# EAGLE schematic CounterModule (EAGLE 7.7.0)

## Sheet 1 of 6: Entrypoint All functionality is connected to the ARM/ZYNC processor by using the I2C-bus. A I2C bus multiplexer (U1) adresses the individual function blocks.
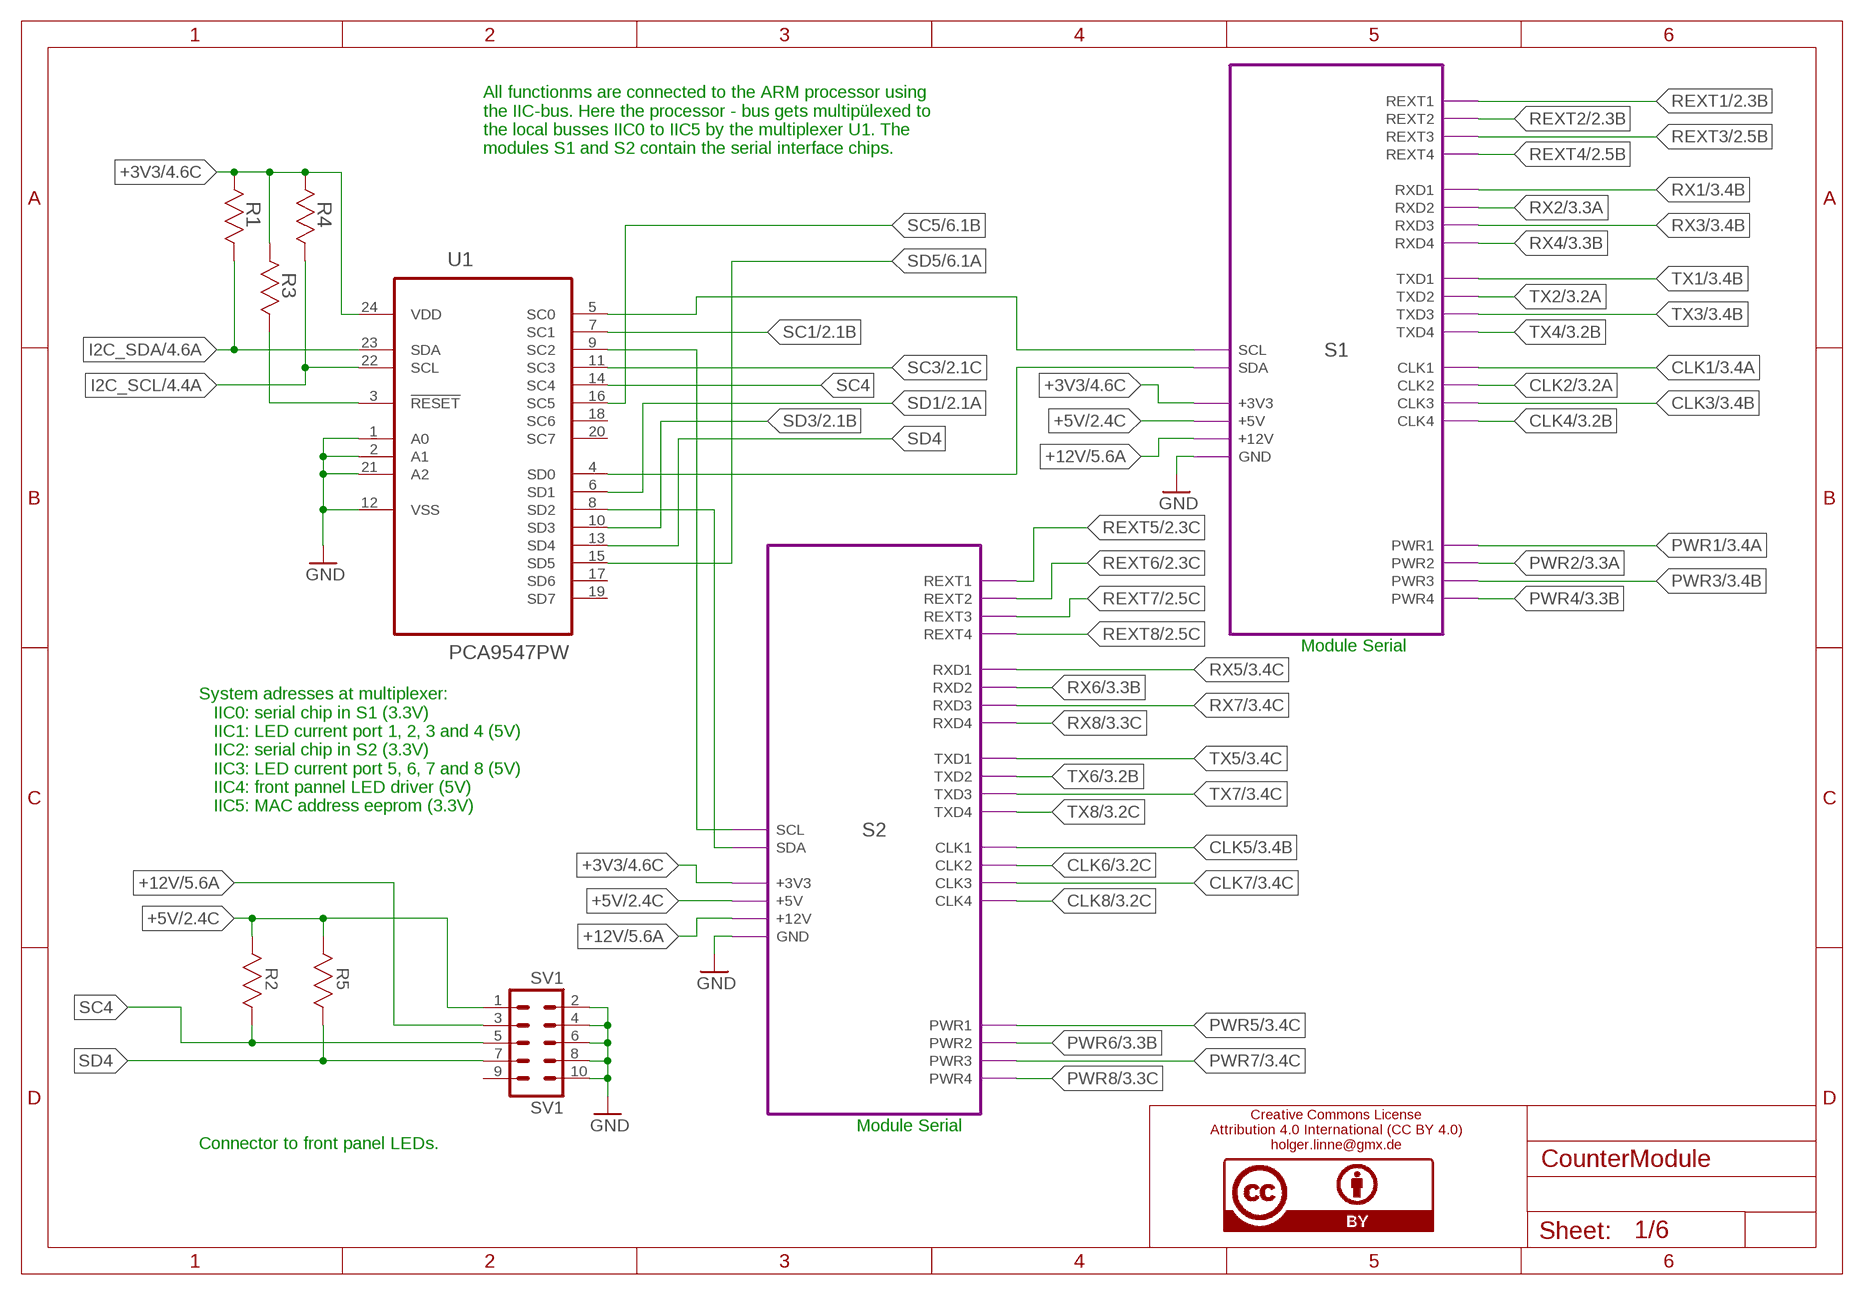
[diagram p0: schematic, sheet 1]

### Parts
R1  4.7 kOhm  ERJ-2RKF4701X  [RESC1005X40N]
R2  4.7 kOhm  ERJ-2RKF4701X  [RESC1005X40N]
R3  4.7 kOhm  ERJ-2RKF4701X  [RESC1005X40N]
R4  4.7 kOhm  ERJ-2RKF4701X  [RESC1005X40N]
R5  4.7 kOhm  ERJ-2RKF4701X  [RESC1005X40N]
SV1  SV1  ML10  [ML10]
U1  PCA9547PW  [SOP65P640X110-24N]

### Module instances
S1 = SERIAL (part numbers offset by 1700)
S2 = SERIAL (part numbers offset by 2700)

### Nets
+3V3 [power]: R1.2(R2) R3.2(R2) R4.2(R2) U1.24(VDD) ; port S1.+3V3 S2.+3V3 ; also sheet 4,5,6
+5V [power]: R2.2(R2) R5.2(R2) SV1.1 ; port S1.+5V S2.+5V ; also sheet 2,4,5,6
+12V [xpower]: SV1.3 ; port S1.+12V S2.+12V ; also sheet 5
CLK1: port S1.CLK1 ; also sheet 3
CLK2: port S1.CLK2 ; also sheet 3
CLK3: port S1.CLK3 ; also sheet 3
CLK4: port S1.CLK4 ; also sheet 3
CLK5: port S2.CLK1 ; also sheet 3
CLK6: port S2.CLK2 ; also sheet 3
CLK7: port S2.CLK3 ; also sheet 3
CLK8: port S2.CLK4 ; also sheet 3
GND [power]: SV1.2 SV1.4 SV1.6 SV1.8 SV1.10 U1.1(A0) U1.2(A1) U1.12(VSS) U1.21(A2) ; port S1.GND S2.GND ; also sheet 2,3,4,5,6
I2C_SCL: R4.1(R1) U1.22(SCL) ; also sheet 4
I2C_SDA: R1.1(R1) U1.23(SDA) ; also sheet 4
N$1: U1.8(SD2) ; port S2.SDA
N$2: U1.9(SC2) ; port S2.SCL
N$3: R3.1(R1) U1.3(!RESET)
PWR1 [xpower]: port S1.PWR1 ; also sheet 3
PWR2 [xpower]: port S1.PWR2 ; also sheet 3
PWR3 [xpower]: port S1.PWR3 ; also sheet 3
PWR4 [xpower]: port S1.PWR4 ; also sheet 3
PWR5 [xpower]: port S2.PWR1 ; also sheet 3
PWR6 [xpower]: port S2.PWR2 ; also sheet 3
PWR7 [xpower]: port S2.PWR3 ; also sheet 3
PWR8 [xpower]: port S2.PWR4 ; also sheet 3
REXT1: port S1.REXT1 ; also sheet 2
REXT2: port S1.REXT2 ; also sheet 2
REXT3: port S1.REXT3 ; also sheet 2
REXT4: port S1.REXT4 ; also sheet 2
REXT5: port S2.REXT1 ; also sheet 2
REXT6: port S2.REXT2 ; also sheet 2
REXT7: port S2.REXT3 ; also sheet 2
REXT8: port S2.REXT4 ; also sheet 2
RX1: port S1.RXD1 ; also sheet 3
RX2: port S1.RXD2 ; also sheet 3
RX3: port S1.RXD3 ; also sheet 3
RX4: port S1.RXD4 ; also sheet 3
RX5: port S2.RXD1 ; also sheet 3
RX6: port S2.RXD2 ; also sheet 3
RX7: port S2.RXD3 ; also sheet 3
RX8: port S2.RXD4 ; also sheet 3
SC0: U1.5(SC0) ; port S1.SCL
SC1: U1.7(SC1) ; also sheet 2
SC3: U1.11(SC3) ; also sheet 2
SC4: R2.1(R1) SV1.5 U1.14(SC4)
SC5: U1.16(SC5) ; also sheet 6
SD0: U1.4(SD0) ; port S1.SDA
SD1: U1.6(SD1) ; also sheet 2
SD3: U1.10(SD3) ; also sheet 2
SD4: R5.1(R1) SV1.7 U1.13(SD4)
SD5: U1.15(SD5) ; also sheet 6
TX1: port S1.TXD1 ; also sheet 3
TX2: port S1.TXD2 ; also sheet 3
TX3: port S1.TXD3 ; also sheet 3
TX4: port S1.TXD4 ; also sheet 3
TX5: port S2.TXD1 ; also sheet 3
TX6: port S2.TXD2 ; also sheet 3
TX7: port S2.TXD3 ; also sheet 3
TX8: port S2.TXD4 ; also sheet 3
Unconnected: SV1.9 U1.17(SD6) U1.18(SC6) U1.19(SD7) U1.20(SC7)

### Notes on the sheet
- All functionms are connected to the ARM processor using
  the IIC-bus. Here the processor - bus gets multipülexed to
  the local busses IIC0 to IIC5 by the multiplexer U1. The
  modules S1 and S2 contain the serial interface chips.
- Module Serial
- System adresses at multiplexer:
     IIC0: serial chip in S1 (3.3V)
     IIC1: LED current port 1, 2, 3 and 4 (5V)
     IIC2: serial chip in S2 (3.3V)
     IIC3: LED current port 5, 6, 7 and 8 (5V)
     IIC4: front pannel LED driver (5V)
     IIC5: MAC address eeprom (3.3V)
- Module Serial
- Connector to front panel LEDs.
- Creative Commons License
  Attribution 4.0 International (CC BY 4.0)
  holger.linne@gmx.de
- /Users/hll/bypig.bmp

## Sheet 2 of 6: LED current controlling variable resistors
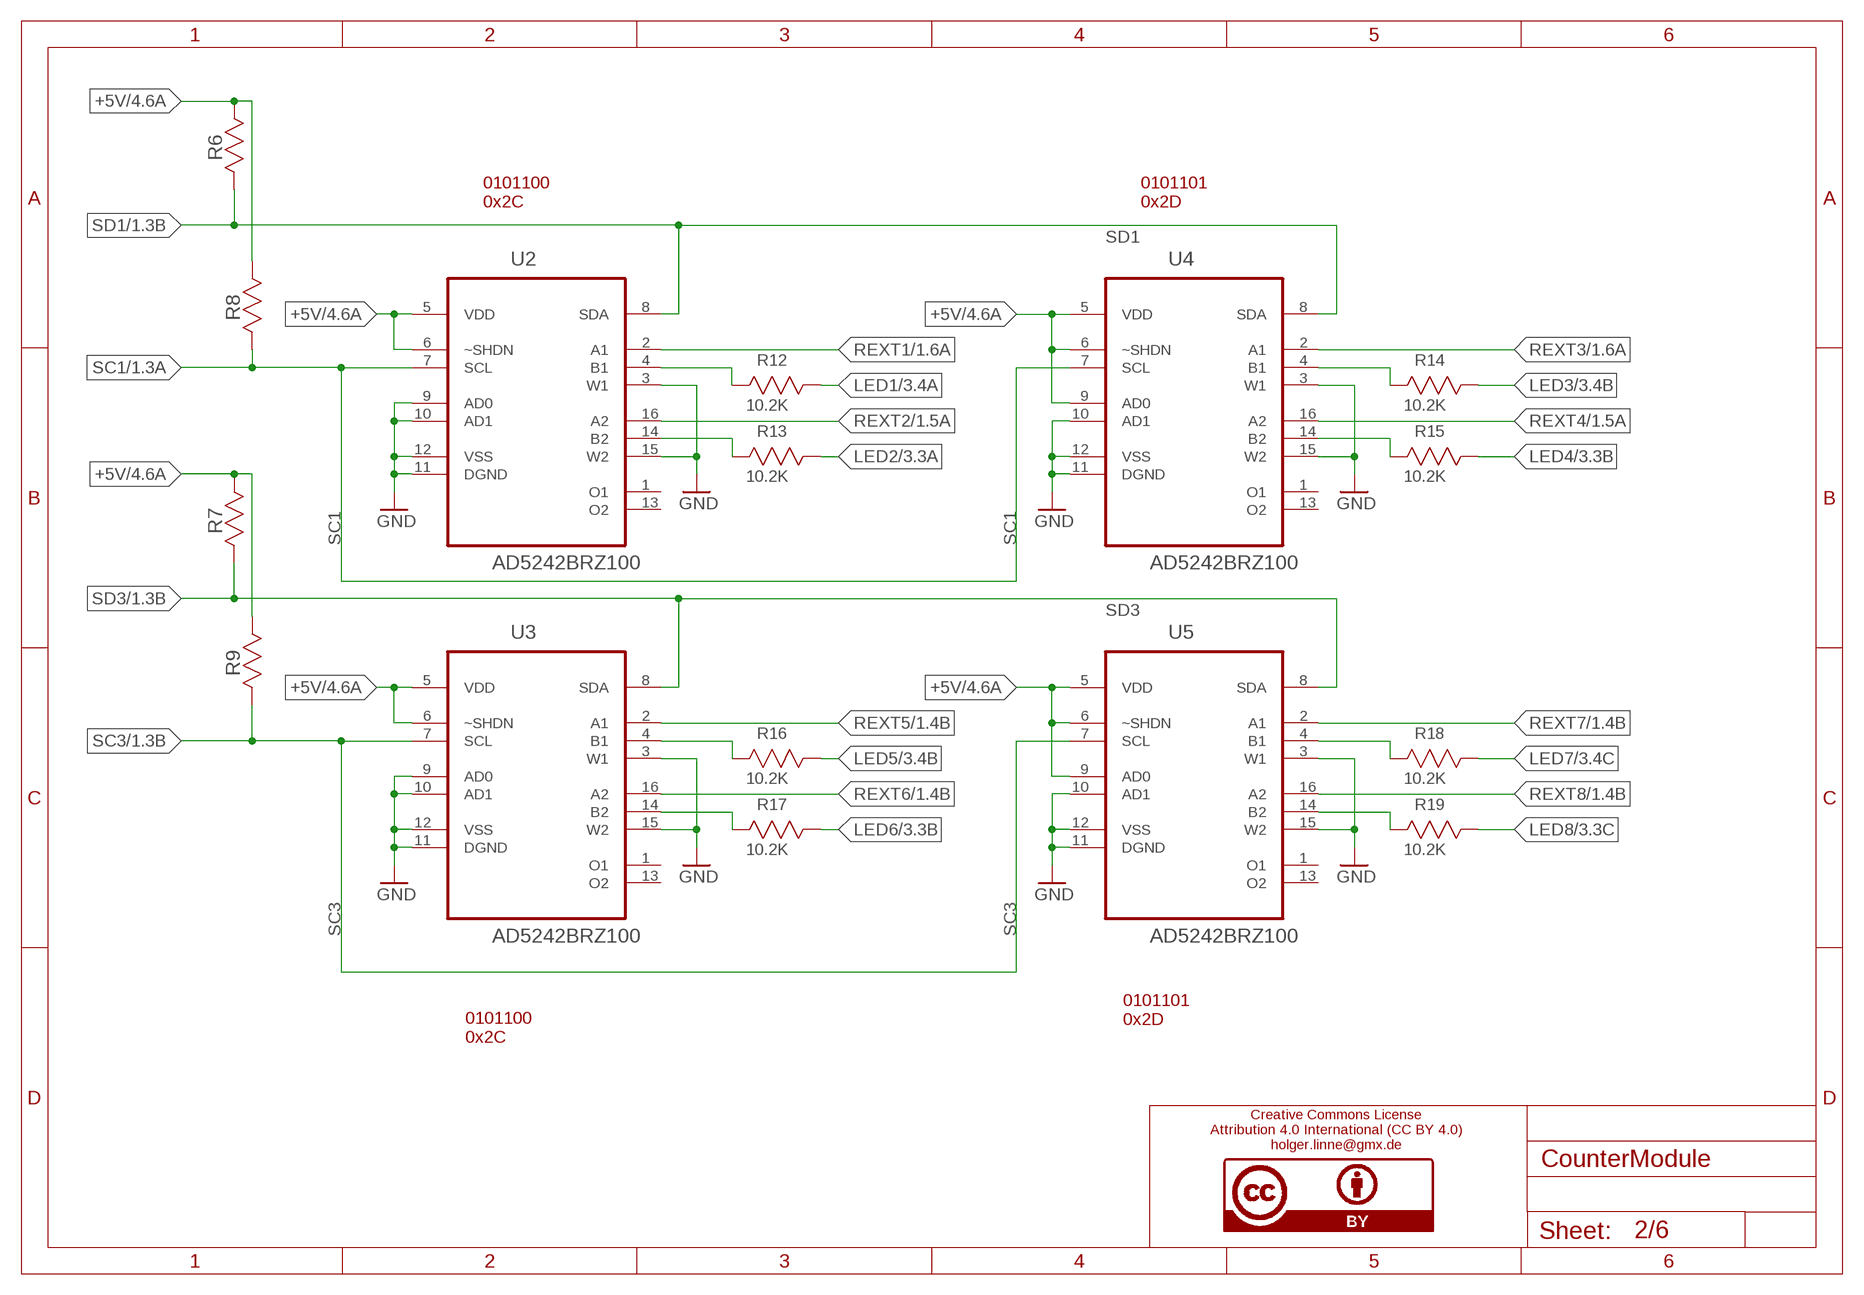
[diagram p1: schematic, sheet 2]

### Parts
R6  4.7 kOhm  ERJ-2RKF4701X  [RESC1005X40N]
R7  4.7 kOhm  ERJ-2RKF4701X  [RESC1005X40N]
R8  4.7 kOhm  ERJ-2RKF4701X  [RESC1005X40N]
R9  4.7 kOhm  ERJ-2RKF4701X  [RESC1005X40N]
R12  10.2K  ERJ-2RKF1022X  [RESC1005X40N]
R13  10.2K  ERJ-2RKF1022X  [RESC1005X40N]
R14  10.2K  ERJ-2RKF1022X  [RESC1005X40N]
R15  10.2K  ERJ-2RKF1022X  [RESC1005X40N]
R16  10.2K  ERJ-2RKF1022X  [RESC1005X40N]
R17  10.2K  ERJ-2RKF1022X  [RESC1005X40N]
R18  10.2K  ERJ-2RKF1022X  [RESC1005X40N]
R19  10.2K  ERJ-2RKF1022X  [RESC1005X40N]
U2  AD5242BRZ100  [SOIC127P600X175-16N]
U3  AD5242BRZ100  [SOIC127P600X175-16N]
U4  AD5242BRZ100  [SOIC127P600X175-16N]
U5  AD5242BRZ100  [SOIC127P600X175-16N]

### Nets
+5V [power]: R6.1(R1) R7.1(R1) R8.1(R1) R9.1(R1) U2.5(VDD) U2.6(~SHDN) U3.5(VDD) U3.6(~SHDN) U4.5(VDD) U4.6(~SHDN) U4.9(AD0) U5.5(VDD) U5.6(~SHDN) U5.9(AD0) ; also sheet 1,4,5,6
GND [power]: U2.3(W1) U2.9(AD0) U2.10(AD1) U2.11(DGND) U2.12(VSS) U2.15(W2) U3.3(W1) U3.9(AD0) U3.10(AD1) U3.11(DGND) U3.12(VSS) U3.15(W2) U4.3(W1) U4.10(AD1) U4.11(DGND) U4.12(VSS) U4.15(W2) U5.3(W1) U5.10(AD1) U5.11(DGND) U5.12(VSS) U5.15(W2) ; also sheet 1,3,4,5,6
LED1: R12.1(R1) ; also sheet 3
LED2: R13.1(R1) ; also sheet 3
LED3: R14.1(R1) ; also sheet 3
LED4: R15.1(R1) ; also sheet 3
LED5: R16.1(R1) ; also sheet 3
LED6: R17.1(R1) ; also sheet 3
LED7: R18.1(R1) ; also sheet 3
LED8: R19.1(R1) ; also sheet 3
N$4: R16.2(R2) U3.4(B1)
N$8: R17.2(R2) U3.14(B2)
N$9: R19.2(R2) U5.14(B2)
N$10: R18.2(R2) U5.4(B1)
N$11: R12.2(R2) U2.4(B1)
N$12: R13.2(R2) U2.14(B2)
N$13: R15.2(R2) U4.14(B2)
N$14: R14.2(R2) U4.4(B1)
REXT1: U2.2(A1) ; also sheet 1
REXT2: U2.16(A2) ; also sheet 1
REXT3: U4.2(A1) ; also sheet 1
REXT4: U4.16(A2) ; also sheet 1
REXT5: U3.2(A1) ; also sheet 1
REXT6: U3.16(A2) ; also sheet 1
REXT7: U5.2(A1) ; also sheet 1
REXT8: U5.16(A2) ; also sheet 1
SC1: R8.2(R2) U2.7(SCL) U4.7(SCL) ; also sheet 1
SC3: R9.2(R2) U3.7(SCL) U5.7(SCL) ; also sheet 1
SD1: R6.2(R2) U2.8(SDA) U4.8(SDA) ; also sheet 1
SD3: R7.2(R2) U3.8(SDA) U5.8(SDA) ; also sheet 1
Unconnected: U2.1(O1) U2.13(O2) U3.1(O1) U3.13(O2) U4.1(O1) U4.13(O2) U5.1(O1) U5.13(O2)

### Notes on the sheet
- 0101100
  0x2C
- 0101101
  0x2D
- 0101101
  0x2D
- 0101100
  0x2C
- Creative Commons License
  Attribution 4.0 International (CC BY 4.0)
  holger.linne@gmx.de
- /Users/hll/bypig.bmp

## Sheet 3 of 6: RJ45 PMT head connector
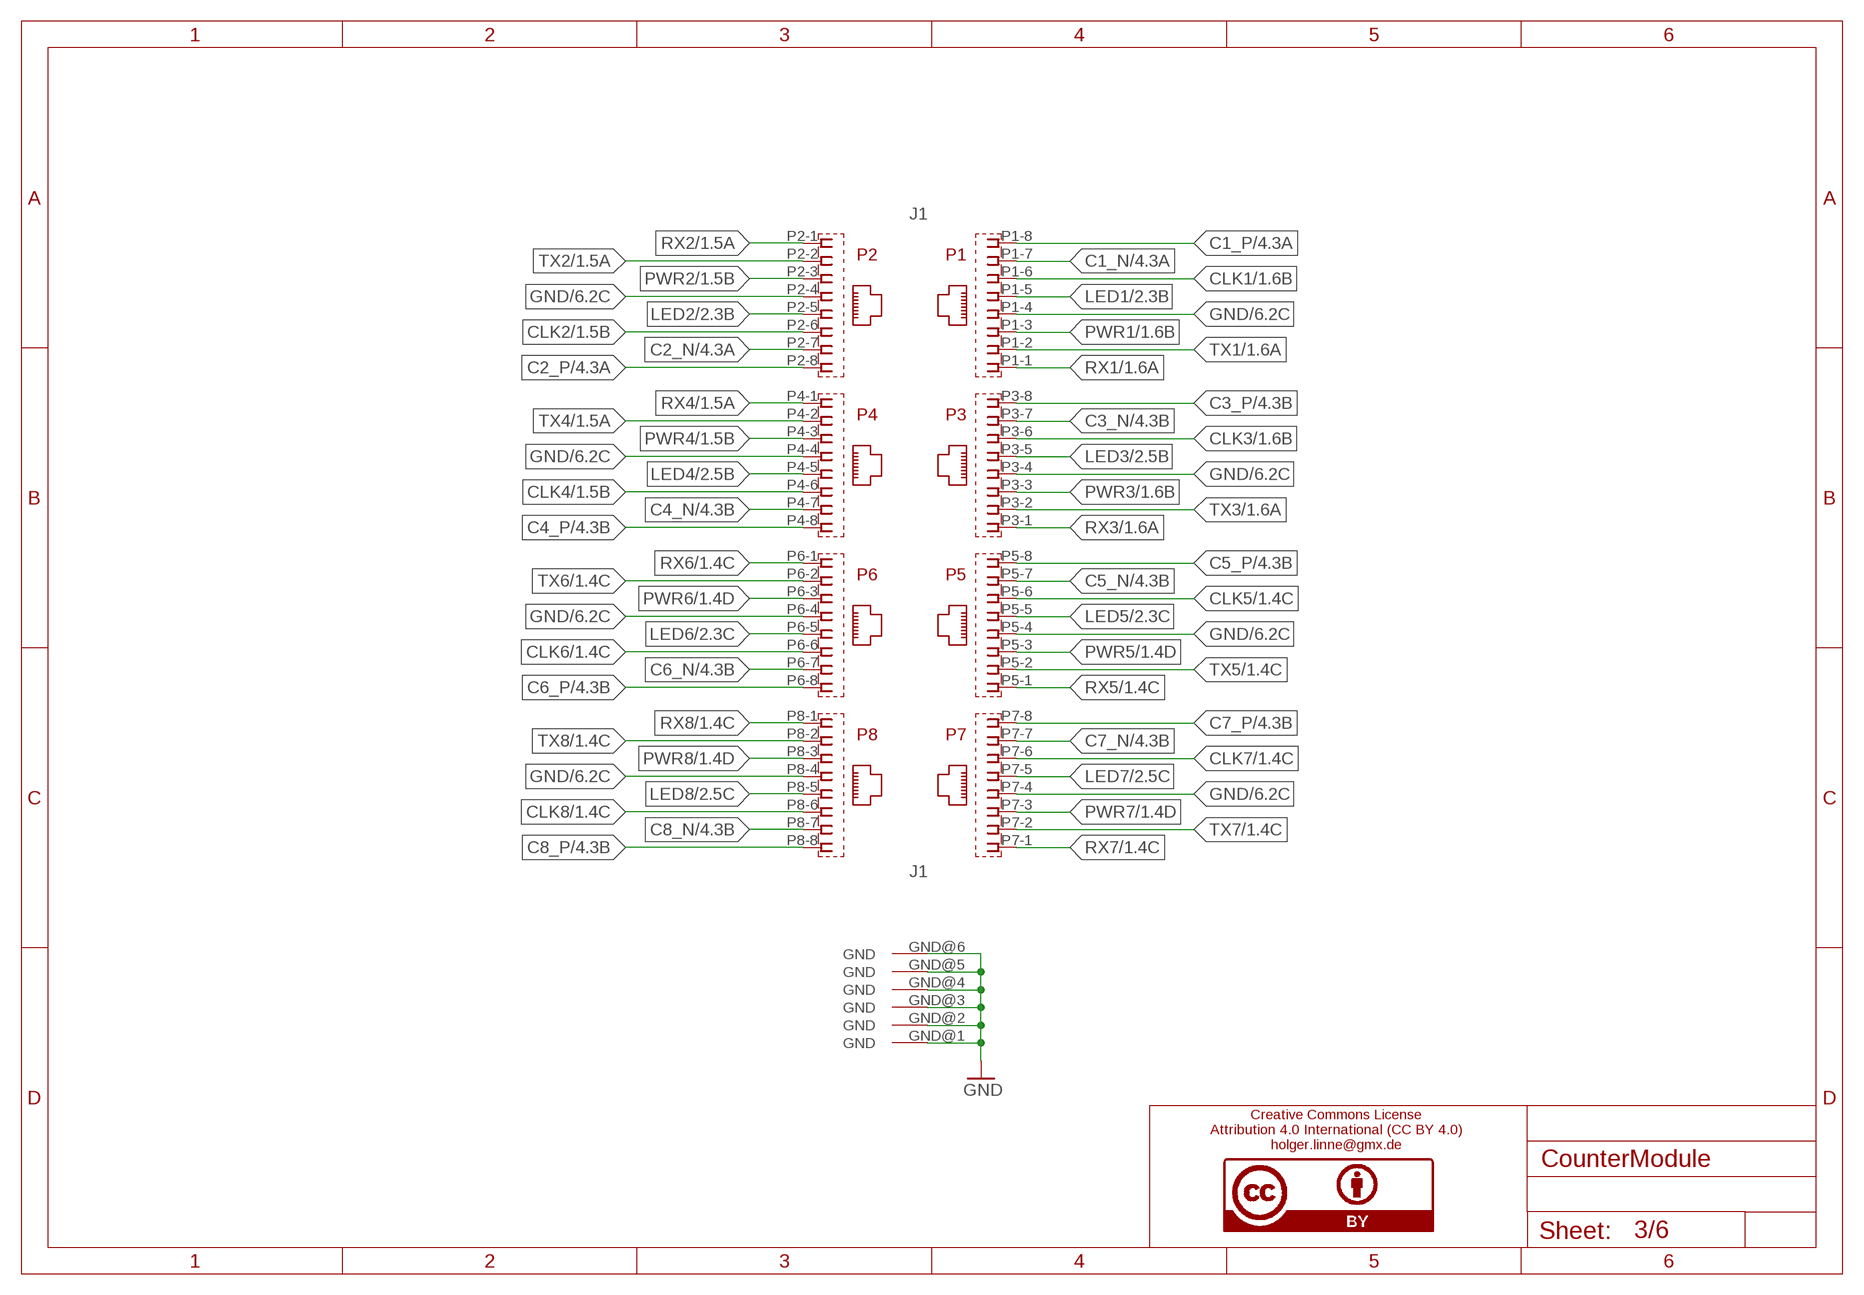
[diagram p2: schematic, sheet 3]

### Parts
J1  J1  AMP2X4  [AMP2X4]

### Nets
C1_N: J1.P1-7 ; also sheet 4
C1_P: J1.P1-8 ; also sheet 4
C2_N: J1.P2-7 ; also sheet 4
C2_P: J1.P2-8 ; also sheet 4
C3_N: J1.P3-7 ; also sheet 4
C3_P: J1.P3-8 ; also sheet 4
C4_N: J1.P4-7 ; also sheet 4
C4_P: J1.P4-8 ; also sheet 4
C5_N: J1.P5-7 ; also sheet 4
C5_P: J1.P5-8 ; also sheet 4
C6_N: J1.P6-7 ; also sheet 4
C6_P: J1.P6-8 ; also sheet 4
C7_N: J1.P7-7 ; also sheet 4
C7_P: J1.P7-8 ; also sheet 4
C8_N: J1.P8-7 ; also sheet 4
C8_P: J1.P8-8 ; also sheet 4
CLK1: J1.P1-6 ; also sheet 1
CLK2: J1.P2-6 ; also sheet 1
CLK3: J1.P3-6 ; also sheet 1
CLK4: J1.P4-6 ; also sheet 1
CLK5: J1.P5-6 ; also sheet 1
CLK6: J1.P6-6 ; also sheet 1
CLK7: J1.P7-6 ; also sheet 1
CLK8: J1.P8-6 ; also sheet 1
GND [power]: J1.GND@1(GND) J1.GND@2(GND) J1.GND@3(GND) J1.GND@4(GND) J1.GND@5(GND) J1.GND@6(GND) J1.P1-4 J1.P2-4 J1.P3-4 J1.P4-4 J1.P5-4 J1.P6-4 J1.P7-4 J1.P8-4 ; also sheet 1,2,4,5,6
LED1: J1.P1-5 ; also sheet 2
LED2: J1.P2-5 ; also sheet 2
LED3: J1.P3-5 ; also sheet 2
LED4: J1.P4-5 ; also sheet 2
LED5: J1.P5-5 ; also sheet 2
LED6: J1.P6-5 ; also sheet 2
LED7: J1.P7-5 ; also sheet 2
LED8: J1.P8-5 ; also sheet 2
PWR1 [xpower]: J1.P1-3 ; also sheet 1
PWR2 [xpower]: J1.P2-3 ; also sheet 1
PWR3 [xpower]: J1.P3-3 ; also sheet 1
PWR4 [xpower]: J1.P4-3 ; also sheet 1
PWR5 [xpower]: J1.P5-3 ; also sheet 1
PWR6 [xpower]: J1.P6-3 ; also sheet 1
PWR7 [xpower]: J1.P7-3 ; also sheet 1
PWR8 [xpower]: J1.P8-3 ; also sheet 1
RX1: J1.P1-1 ; also sheet 1
RX2: J1.P2-1 ; also sheet 1
RX3: J1.P3-1 ; also sheet 1
RX4: J1.P4-1 ; also sheet 1
RX5: J1.P5-1 ; also sheet 1
RX6: J1.P6-1 ; also sheet 1
RX7: J1.P7-1 ; also sheet 1
RX8: J1.P8-1 ; also sheet 1
TX1: J1.P1-2 ; also sheet 1
TX2: J1.P2-2 ; also sheet 1
TX3: J1.P3-2 ; also sheet 1
TX4: J1.P4-2 ; also sheet 1
TX5: J1.P5-2 ; also sheet 1
TX6: J1.P6-2 ; also sheet 1
TX7: J1.P7-2 ; also sheet 1
TX8: J1.P8-2 ; also sheet 1

### Notes on the sheet
- Creative Commons License
  Attribution 4.0 International (CC BY 4.0)
  holger.linne@gmx.de
- /Users/hll/bypig.bmp

## Sheet 4 of 6: MicroZed high density connectors
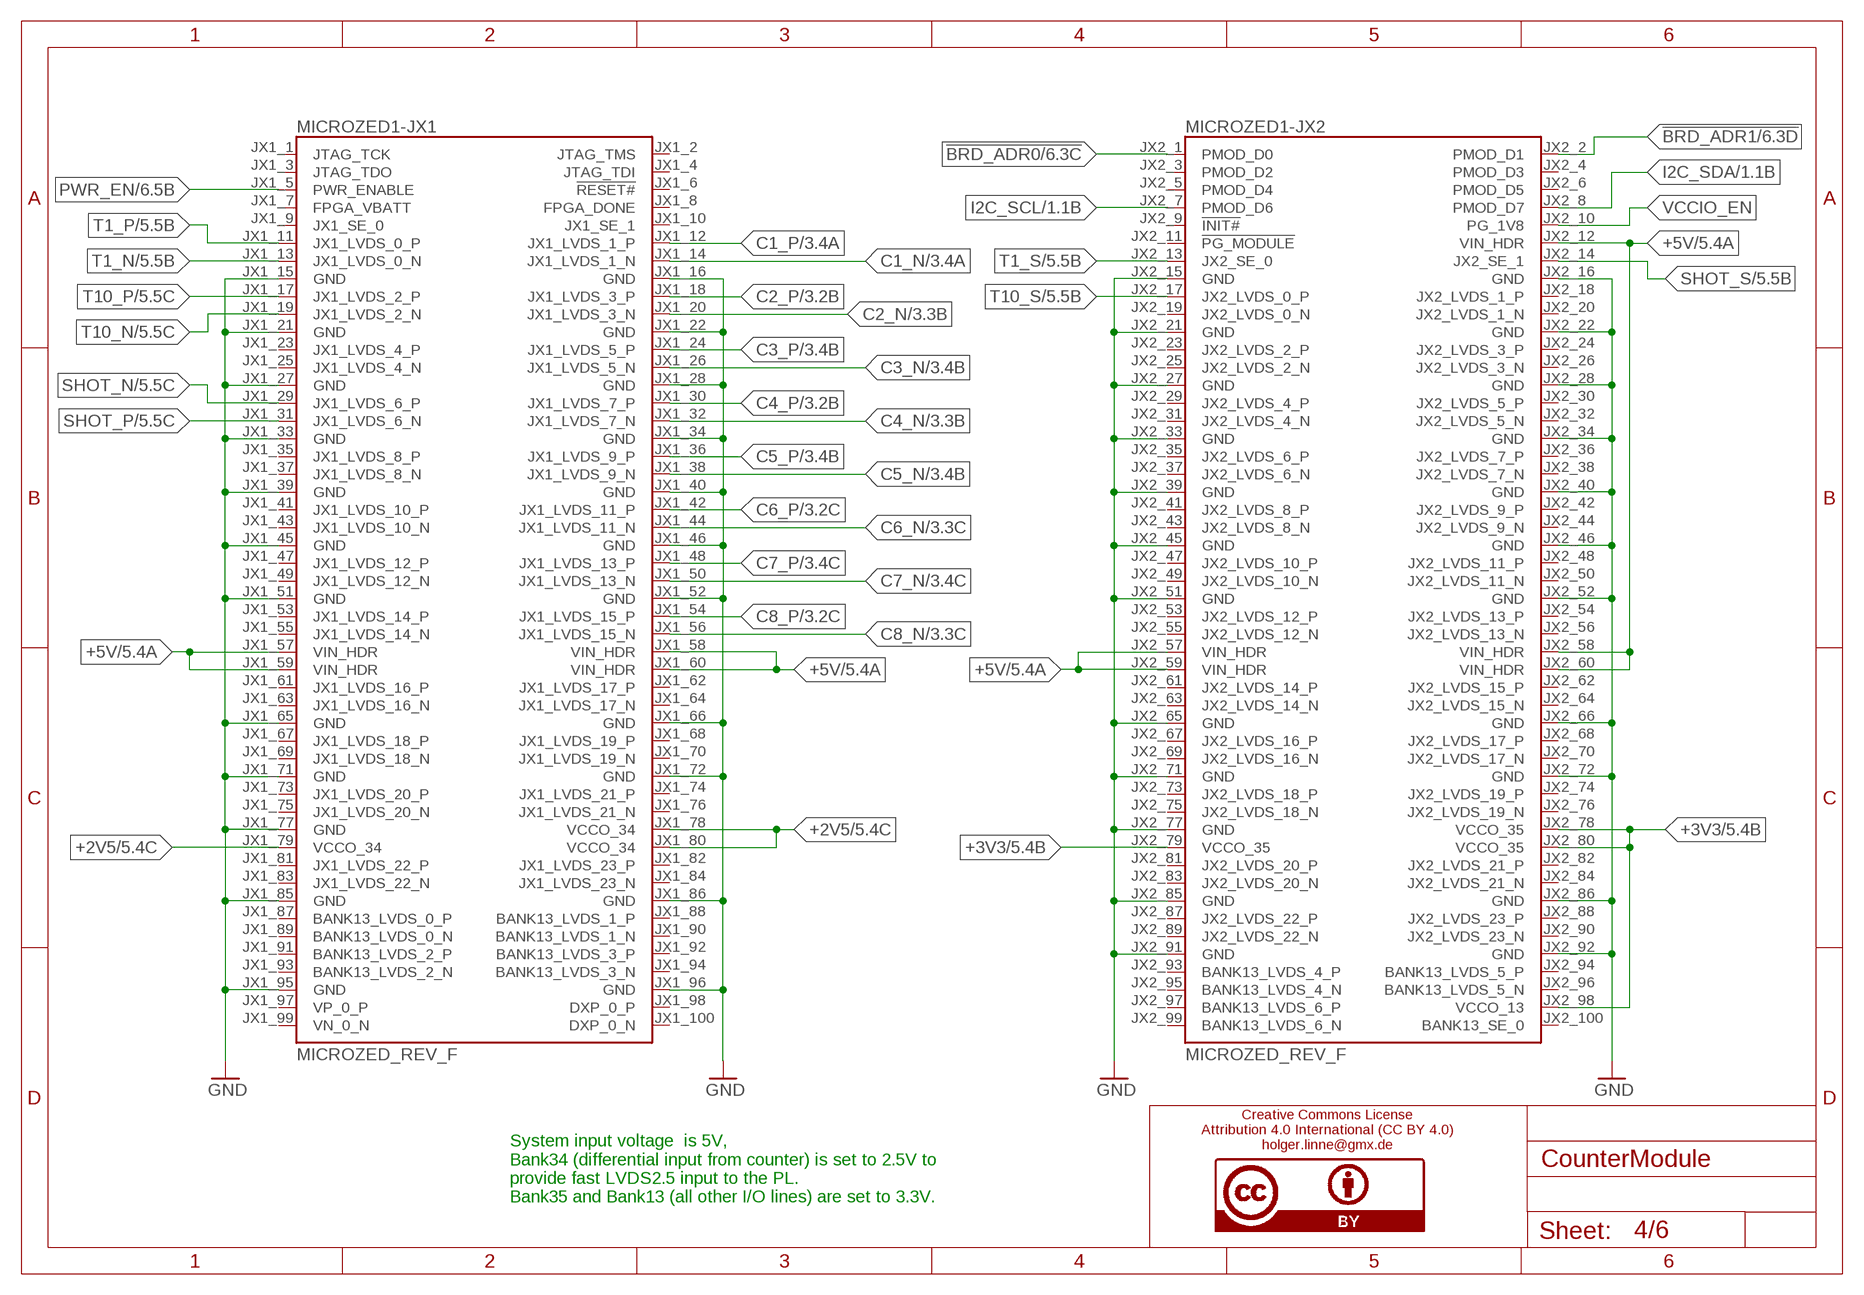
[diagram p3: schematic, sheet 4]

### Parts
MICROZED1  MICROZED_REV_F  [MICROZED_REV_F]

### Nets
!BRD_ADR0: MICROZED1.JX2_1(-JX2:PMOD_D0) ; also sheet 6
!BRD_ADR1: MICROZED1.JX2_2(-JX2:PMOD_D1) ; also sheet 6
+2V5 [xpower]: MICROZED1.JX1_78(-JX1:VCCO_34) MICROZED1.JX1_79(-JX1:VCCO_34) MICROZED1.JX1_80(-JX1:VCCO_34) ; also sheet 5
+3V3 [power]: MICROZED1.JX2_78(-JX2:VCCO_35) MICROZED1.JX2_79(-JX2:VCCO_35) MICROZED1.JX2_80(-JX2:VCCO_35) MICROZED1.JX2_98(-JX2:VCCO_13) ; also sheet 1,5,6
+5V [power]: MICROZED1.JX1_57(-JX1:VIN_HDR) MICROZED1.JX1_58(-JX1:VIN_HDR) MICROZED1.JX1_59(-JX1:VIN_HDR) MICROZED1.JX1_60(-JX1:VIN_HDR) MICROZED1.JX2_12(-JX2:VIN_HDR) MICROZED1.JX2_57(-JX2:VIN_HDR) MICROZED1.JX2_58(-JX2:VIN_HDR) MICROZED1.JX2_59(-JX2:VIN_HDR) MICROZED1.JX2_60(-JX2:VIN_HDR) ; also sheet 1,2,5,6
C1_N: MICROZED1.JX1_14(-JX1:JX1_LVDS_1_N) ; also sheet 3
C1_P: MICROZED1.JX1_12(-JX1:JX1_LVDS_1_P) ; also sheet 3
C2_N: MICROZED1.JX1_20(-JX1:JX1_LVDS_3_N) ; also sheet 3
C2_P: MICROZED1.JX1_18(-JX1:JX1_LVDS_3_P) ; also sheet 3
C3_N: MICROZED1.JX1_26(-JX1:JX1_LVDS_5_N) ; also sheet 3
C3_P: MICROZED1.JX1_24(-JX1:JX1_LVDS_5_P) ; also sheet 3
C4_N: MICROZED1.JX1_32(-JX1:JX1_LVDS_7_N) ; also sheet 3
C4_P: MICROZED1.JX1_30(-JX1:JX1_LVDS_7_P) ; also sheet 3
C5_N: MICROZED1.JX1_38(-JX1:JX1_LVDS_9_N) ; also sheet 3
C5_P: MICROZED1.JX1_36(-JX1:JX1_LVDS_9_P) ; also sheet 3
C6_N: MICROZED1.JX1_44(-JX1:JX1_LVDS_11_N) ; also sheet 3
C6_P: MICROZED1.JX1_42(-JX1:JX1_LVDS_11_P) ; also sheet 3
C7_N: MICROZED1.JX1_50(-JX1:JX1_LVDS_13_N) ; also sheet 3
C7_P: MICROZED1.JX1_48(-JX1:JX1_LVDS_13_P) ; also sheet 3
C8_N: MICROZED1.JX1_56(-JX1:JX1_LVDS_15_N) ; also sheet 3
C8_P: MICROZED1.JX1_54(-JX1:JX1_LVDS_15_P) ; also sheet 3
GND [power]: MICROZED1.JX1_15(-JX1:GND) MICROZED1.JX1_16(-JX1:GND) MICROZED1.JX1_21(-JX1:GND) MICROZED1.JX1_22(-JX1:GND) MICROZED1.JX1_27(-JX1:GND) MICROZED1.JX1_28(-JX1:GND) MICROZED1.JX1_33(-JX1:GND) MICROZED1.JX1_34(-JX1:GND) MICROZED1.JX1_39(-JX1:GND) MICROZED1.JX1_40(-JX1:GND) MICROZED1.JX1_45(-JX1:GND) MICROZED1.JX1_46(-JX1:GND) MICROZED1.JX1_51(-JX1:GND) MICROZED1.JX1_52(-JX1:GND) MICROZED1.JX1_65(-JX1:GND) MICROZED1.JX1_66(-JX1:GND) MICROZED1.JX1_71(-JX1:GND) MICROZED1.JX1_72(-JX1:GND) MICROZED1.JX1_77(-JX1:GND) MICROZED1.JX1_85(-JX1:GND) MICROZED1.JX1_86(-JX1:GND) MICROZED1.JX1_95(-JX1:GND) MICROZED1.JX1_96(-JX1:GND) MICROZED1.JX2_15(-JX2:GND) MICROZED1.JX2_16(-JX2:GND) MICROZED1.JX2_21(-JX2:GND) MICROZED1.JX2_22(-JX2:GND) MICROZED1.JX2_27(-JX2:GND) MICROZED1.JX2_28(-JX2:GND) MICROZED1.JX2_33(-JX2:GND) MICROZED1.JX2_34(-JX2:GND) MICROZED1.JX2_39(-JX2:GND) MICROZED1.JX2_40(-JX2:GND) MICROZED1.JX2_45(-JX2:GND) MICROZED1.JX2_46(-JX2:GND) MICROZED1.JX2_51(-JX2:GND) MICROZED1.JX2_52(-JX2:GND) MICROZED1.JX2_65(-JX2:GND) MICROZED1.JX2_66(-JX2:GND) MICROZED1.JX2_71(-JX2:GND) MICROZED1.JX2_72(-JX2:GND) MICROZED1.JX2_77(-JX2:GND) MICROZED1.JX2_85(-JX2:GND) MICROZED1.JX2_86(-JX2:GND) MICROZED1.JX2_91(-JX2:GND) MICROZED1.JX2_92(-JX2:GND) ; also sheet 1,2,3,5,6
I2C_SCL: MICROZED1.JX2_7(-JX2:PMOD_D6) ; also sheet 1
I2C_SDA: MICROZED1.JX2_8(-JX2:PMOD_D7) ; also sheet 1
PWR_EN: MICROZED1.JX1_5(-JX1:PWR_ENABLE) ; also sheet 6
SHOT_N: MICROZED1.JX1_29(-JX1:JX1_LVDS_6_P) ; also sheet 5
SHOT_P: MICROZED1.JX1_31(-JX1:JX1_LVDS_6_N) ; also sheet 5
SHOT_S: MICROZED1.JX2_14(-JX2:JX2_SE_1) ; also sheet 5
T1_N: MICROZED1.JX1_13(-JX1:JX1_LVDS_0_N) ; also sheet 5
T1_P: MICROZED1.JX1_11(-JX1:JX1_LVDS_0_P) ; also sheet 5
T1_S: MICROZED1.JX2_13(-JX2:JX2_SE_0) ; also sheet 5
T10_N: MICROZED1.JX1_19(-JX1:JX1_LVDS_2_N) ; also sheet 5
T10_P: MICROZED1.JX1_17(-JX1:JX1_LVDS_2_P) ; also sheet 5
T10_S: MICROZED1.JX2_17(-JX2:JX2_LVDS_0_P) ; also sheet 5
VCCIO_EN: MICROZED1.JX2_10(-JX2:PG_1V8)
Unconnected: MICROZED1.JX1_1(-JX1:JTAG_TCK) MICROZED1.JX1_2(-JX1:JTAG_TMS) MICROZED1.JX1_3(-JX1:JTAG_TDO) MICROZED1.JX1_4(-JX1:JTAG_TDI) MICROZED1.JX1_6(-JX1:!RESET#) MICROZED1.JX1_7(-JX1:FPGA_VBATT) MICROZED1.JX1_8(-JX1:FPGA_DONE) MICROZED1.JX1_9(-JX1:JX1_SE_0) MICROZED1.JX1_10(-JX1:JX1_SE_1) MICROZED1.JX1_23(-JX1:JX1_LVDS_4_P) MICROZED1.JX1_25(-JX1:JX1_LVDS_4_N) MICROZED1.JX1_35(-JX1:JX1_LVDS_8_P) MICROZED1.JX1_37(-JX1:JX1_LVDS_8_N) MICROZED1.JX1_41(-JX1:JX1_LVDS_10_P) MICROZED1.JX1_43(-JX1:JX1_LVDS_10_N) MICROZED1.JX1_47(-JX1:JX1_LVDS_12_P) MICROZED1.JX1_49(-JX1:JX1_LVDS_12_N) MICROZED1.JX1_53(-JX1:JX1_LVDS_14_P) MICROZED1.JX1_55(-JX1:JX1_LVDS_14_N) MICROZED1.JX1_61(-JX1:JX1_LVDS_16_P) MICROZED1.JX1_62(-JX1:JX1_LVDS_17_P) MICROZED1.JX1_63(-JX1:JX1_LVDS_16_N) MICROZED1.JX1_64(-JX1:JX1_LVDS_17_N) MICROZED1.JX1_67(-JX1:JX1_LVDS_18_P) MICROZED1.JX1_68(-JX1:JX1_LVDS_19_P) MICROZED1.JX1_69(-JX1:JX1_LVDS_18_N) MICROZED1.JX1_70(-JX1:JX1_LVDS_19_N) MICROZED1.JX1_73(-JX1:JX1_LVDS_20_P) MICROZED1.JX1_74(-JX1:JX1_LVDS_21_P) MICROZED1.JX1_75(-JX1:JX1_LVDS_20_N) MICROZED1.JX1_76(-JX1:JX1_LVDS_21_N) MICROZED1.JX1_81(-JX1:JX1_LVDS_22_P) MICROZED1.JX1_82(-JX1:JX1_LVDS_23_P) MICROZED1.JX1_83(-JX1:JX1_LVDS_22_N) MICROZED1.JX1_84(-JX1:JX1_LVDS_23_N) MICROZED1.JX1_87(-JX1:BANK13_LVDS_0_P) MICROZED1.JX1_88(-JX1:BANK13_LVDS_1_P) MICROZED1.JX1_89(-JX1:BANK13_LVDS_0_N) MICROZED1.JX1_90(-JX1:BANK13_LVDS_1_N) MICROZED1.JX1_91(-JX1:BANK13_LVDS_2_P) MICROZED1.JX1_92(-JX1:BANK13_LVDS_3_P) MICROZED1.JX1_93(-JX1:BANK13_LVDS_2_N) MICROZED1.JX1_94(-JX1:BANK13_LVDS_3_N) MICROZED1.JX1_97(-JX1:VP_0_P) MICROZED1.JX1_98(-JX1:DXP_0_P) MICROZED1.JX1_99(-JX1:VN_0_N) MICROZED1.JX1_100(-JX1:DXP_0_N) MICROZED1.JX2_3(-JX2:PMOD_D2) MICROZED1.JX2_4(-JX2:PMOD_D3) MICROZED1.JX2_5(-JX2:PMOD_D4) MICROZED1.JX2_6(-JX2:PMOD_D5) MICROZED1.JX2_9(-JX2:!INIT#) MICROZED1.JX2_11(-JX2:!PG_MODULE) MICROZED1.JX2_18(-JX2:JX2_LVDS_1_P) MICROZED1.JX2_19(-JX2:JX2_LVDS_0_N) MICROZED1.JX2_20(-JX2:JX2_LVDS_1_N) MICROZED1.JX2_23(-JX2:JX2_LVDS_2_P) MICROZED1.JX2_24(-JX2:JX2_LVDS_3_P) MICROZED1.JX2_25(-JX2:JX2_LVDS_2_N) MICROZED1.JX2_26(-JX2:JX2_LVDS_3_N) MICROZED1.JX2_29(-JX2:JX2_LVDS_4_P) MICROZED1.JX2_30(-JX2:JX2_LVDS_5_P) MICROZED1.JX2_31(-JX2:JX2_LVDS_4_N) MICROZED1.JX2_32(-JX2:JX2_LVDS_5_N) MICROZED1.JX2_35(-JX2:JX2_LVDS_6_P) MICROZED1.JX2_36(-JX2:JX2_LVDS_7_P) MICROZED1.JX2_37(-JX2:JX2_LVDS_6_N) MICROZED1.JX2_38(-JX2:JX2_LVDS_7_N) MICROZED1.JX2_41(-JX2:JX2_LVDS_8_P) MICROZED1.JX2_42(-JX2:JX2_LVDS_9_P) MICROZED1.JX2_43(-JX2:JX2_LVDS_8_N) MICROZED1.JX2_44(-JX2:JX2_LVDS_9_N) MICROZED1.JX2_47(-JX2:JX2_LVDS_10_P) MICROZED1.JX2_48(-JX2:JX2_LVDS_11_P) MICROZED1.JX2_49(-JX2:JX2_LVDS_10_N) MICROZED1.JX2_50(-JX2:JX2_LVDS_11_N) MICROZED1.JX2_53(-JX2:JX2_LVDS_12_P) MICROZED1.JX2_54(-JX2:JX2_LVDS_13_P) MICROZED1.JX2_55(-JX2:JX2_LVDS_12_N) MICROZED1.JX2_56(-JX2:JX2_LVDS_13_N) MICROZED1.JX2_61(-JX2:JX2_LVDS_14_P) MICROZED1.JX2_62(-JX2:JX2_LVDS_15_P) MICROZED1.JX2_63(-JX2:JX2_LVDS_14_N) MICROZED1.JX2_64(-JX2:JX2_LVDS_15_N) MICROZED1.JX2_67(-JX2:JX2_LVDS_16_P) MICROZED1.JX2_68(-JX2:JX2_LVDS_17_P) MICROZED1.JX2_69(-JX2:JX2_LVDS_16_N) MICROZED1.JX2_70(-JX2:JX2_LVDS_17_N) MICROZED1.JX2_73(-JX2:JX2_LVDS_18_P) MICROZED1.JX2_74(-JX2:JX2_LVDS_19_P) MICROZED1.JX2_75(-JX2:JX2_LVDS_18_N) MICROZED1.JX2_76(-JX2:JX2_LVDS_19_N) MICROZED1.JX2_81(-JX2:JX2_LVDS_20_P) MICROZED1.JX2_82(-JX2:JX2_LVDS_21_P) MICROZED1.JX2_83(-JX2:JX2_LVDS_20_N) MICROZED1.JX2_84(-JX2:JX2_LVDS_21_N) MICROZED1.JX2_87(-JX2:JX2_LVDS_22_P) MICROZED1.JX2_88(-JX2:JX2_LVDS_23_P) MICROZED1.JX2_89(-JX2:JX2_LVDS_22_N) MICROZED1.JX2_90(-JX2:JX2_LVDS_23_N) MICROZED1.JX2_93(-JX2:BANK13_LVDS_4_P) MICROZED1.JX2_94(-JX2:BANK13_LVDS_5_P) MICROZED1.JX2_95(-JX2:BANK13_LVDS_4_N) MICROZED1.JX2_96(-JX2:BANK13_LVDS_5_N) MICROZED1.JX2_97(-JX2:BANK13_LVDS_6_P) MICROZED1.JX2_99(-JX2:BANK13_LVDS_6_N) MICROZED1.JX2_100(-JX2:BANK13_SE_0)

### Notes on the sheet
- Creative Commons License
  Attribution 4.0 International (CC BY 4.0)
  holger.linne@gmx.de
- System input voltage  is 5V,
  Bank34 (differential input from counter) is set to 2.5V to
  provide fast LVDS2.5 input to the PL.
  Bank35 and Bank13 (all other I/O lines) are set to 3.3V.
- /Users/hll/bypig.bmp

## Sheet 5 of 6: Power supply
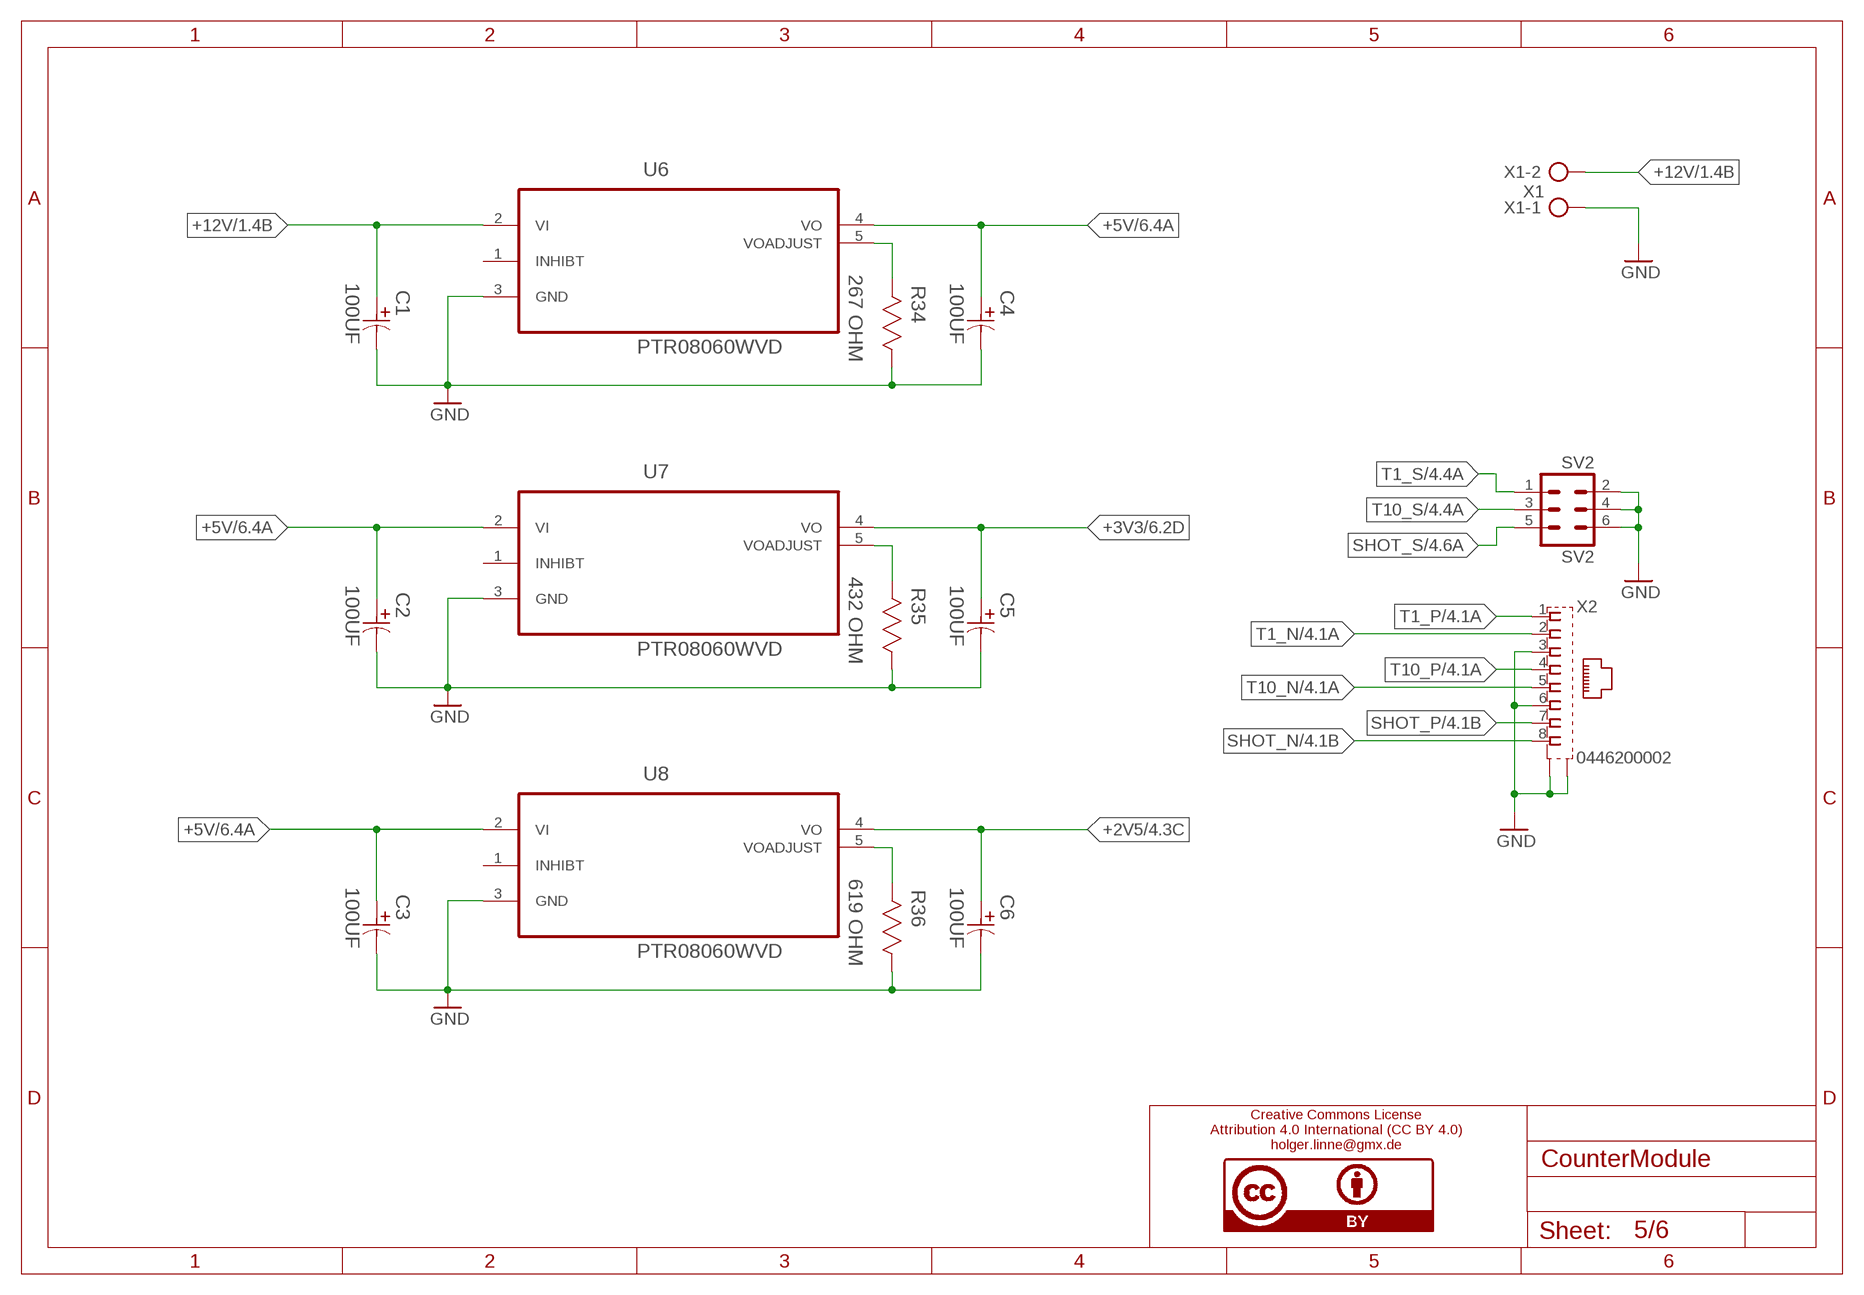
[diagram p4: schematic, sheet 5]

### Parts
C1  100UF  EEE-FK1E101XP-CASE-D8  [CAPAE660X800N]
C2  100UF  EEE-FK1E101XP-CASE-D8  [CAPAE660X800N]
C3  100UF  EEE-FK1E101XP-CASE-D8  [CAPAE660X800N]
C4  100UF  EEE-FK1E101XP-CASE-D8  [CAPAE660X800N]
C5  100UF  EEE-FK1E101XP-CASE-D8  [CAPAE660X800N]
C6  100UF  EEE-FK1E101XP-CASE-D8  [CAPAE660X800N]
R34  267 OHM  ERJ-2RKF2670X  [RESC1005X40N]
R35  432 OHM  ERJ-2RKF4320X  [RESC1005X40N]
R36  619 OHM  ERJ-2RKF6190X  [RESC1005X40N]
SV2  SV2  ML6  [ML6]
U6  PTR08060WVD  [TI_PTR08060WVD]
U7  PTR08060WVD  [TI_PTR08060WVD]
U8  PTR08060WVD  [TI_PTR08060WVD]
X1  X1  AK300/2  [AK300/2]
X2  0446200002  [0446200002]

### Nets
+2V5 [xpower]: C6.1 U8.4(VO) ; also sheet 4
+3V3 [power]: C5.1 U7.4(VO) ; also sheet 1,4,6
+5V [power]: C2.1 C3.1 C4.1 U6.4(VO) U7.2(VI) U8.2(VI) ; also sheet 1,2,4,6
+12V [xpower]: C1.1 U6.2(VI) X1.2 ; also sheet 1
GND [power]: C1.2 C2.2 C3.2 C4.2 C5.2 C6.2 R34.1(R1) R35.1(R1) R36.1(R1) SV2.2 SV2.4 SV2.6 U6.3(GND) U7.3(GND) U8.3(GND) X1.1 X2.3 X2.6 X2.S@1(S1) X2.S@2(S2) ; also sheet 1,2,3,4,6
N$23: R34.2(R2) U6.5(VOADJUST)
N$24: R36.2(R2) U8.5(VOADJUST)
N$26: R35.2(R2) U7.5(VOADJUST)
SHOT_N: X2.8 ; also sheet 4
SHOT_P: X2.7 ; also sheet 4
SHOT_S: SV2.5 ; also sheet 4
T1_N: X2.2 ; also sheet 4
T1_P: X2.1 ; also sheet 4
T1_S: SV2.1 ; also sheet 4
T10_N: X2.5 ; also sheet 4
T10_P: X2.4 ; also sheet 4
T10_S: SV2.3 ; also sheet 4
Unconnected: U6.1(INHIBT) U7.1(INHIBT) U8.1(INHIBT)

### Notes on the sheet
- Creative Commons License
  Attribution 4.0 International (CC BY 4.0)
  holger.linne@gmx.de
- /Users/hll/bypig.bmp

## Sheet 6 of 6: Microzed support
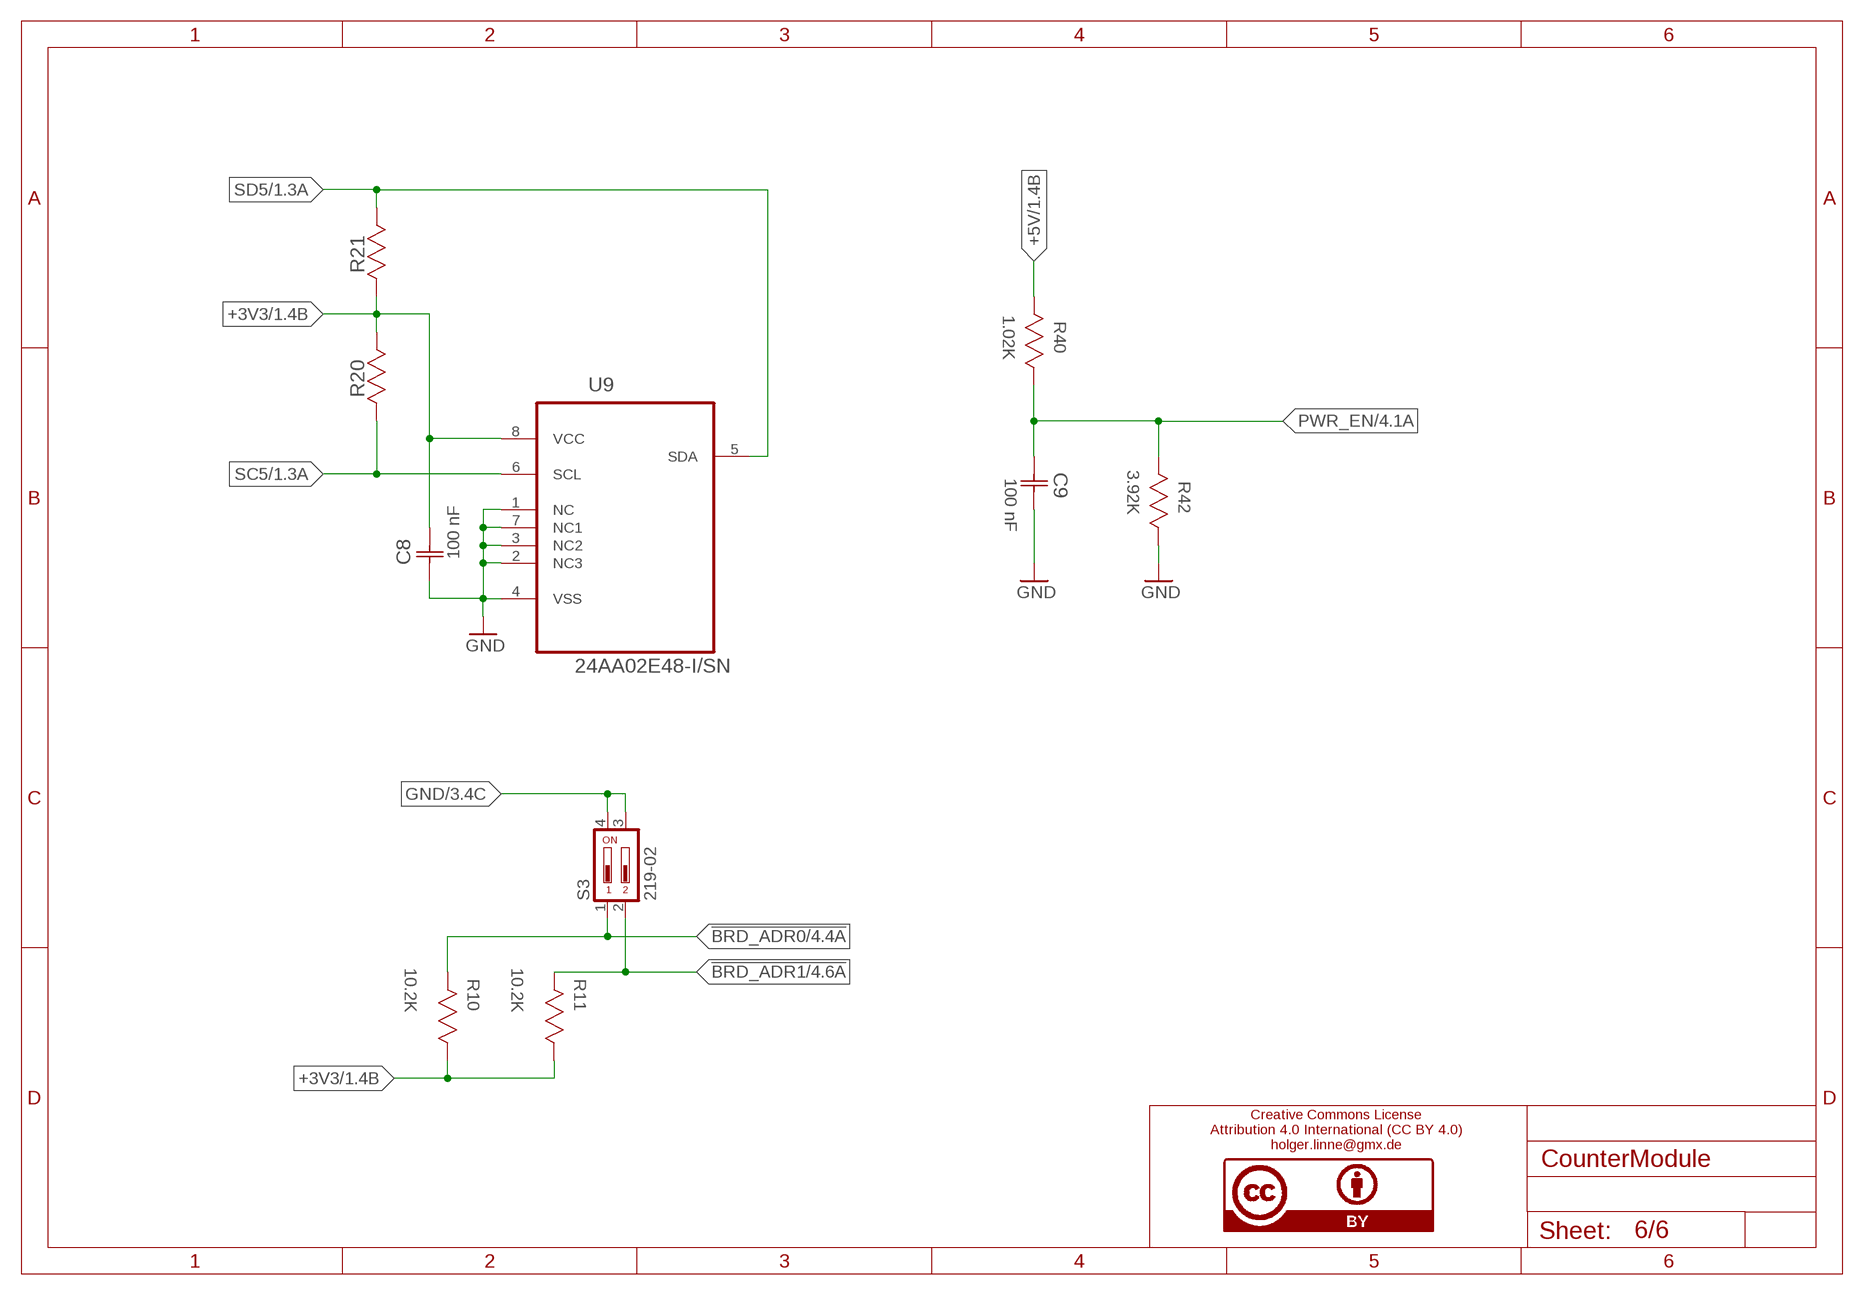
[diagram p5: schematic, sheet 6]

### Parts
C8  100 nF  C0402C104K8PACTU  [CAPC1005X60N]
C9  100 nF  C0402C104K8PACTU  [CAPC1005X60N]
R10  10.2K  ERJ-2RKF1022X  [RESC1005X40N]
R11  10.2K  ERJ-2RKF1022X  [RESC1005X40N]
R20  4.7 kOhm  ERJ-2RKF4701X  [RESC1005X40N]
R21  4.7 kOhm  ERJ-2RKF4701X  [RESC1005X40N]
R40  1.02K  ERJ-2RKF1021X  [RESC1005X40N]
R42  3.92K  ERJ-2RKF3921X  [RESC1005X40N]
S3  219-02  [CTS-219-02]
U9  24AA02E48-I/SN  [SOIC127P600X175-8N]

### Nets
!BRD_ADR0: R10.2(R2) S3.1 ; also sheet 4
!BRD_ADR1: R11.2(R2) S3.2 ; also sheet 4
+3V3 [power]: C8.1(C1) R10.1(R1) R11.1(R1) R20.1(R1) R21.2(R2) U9.8(VCC) ; also sheet 1,4,5
+5V [power]: R40.2(R2) ; also sheet 1,2,4,5
GND [power]: C8.2(C2) C9.1(C1) R42.1(R1) S3.3 S3.4 U9.1(NC) U9.2(NC3) U9.3(NC2) U9.4(VSS) U9.7(NC1) ; also sheet 1,2,3,4,5
PWR_EN: C9.2(C2) R40.1(R1) R42.2(R2) ; also sheet 4
SC5: R20.2(R2) U9.6(SCL) ; also sheet 1
SD5: R21.1(R1) U9.5(SDA) ; also sheet 1

### Notes on the sheet
- Creative Commons License
  Attribution 4.0 International (CC BY 4.0)
  holger.linne@gmx.de
- /Users/hll/bypig.bmp

## Library data of the parts
C1-C6 = Panasonic-EEEFK_EEEFP:EEE-: Aluminum Electrolytic Capacitors,Surface Mount Type; MPN: EEE-FK1E101XP; OC_FARNELL: 1850109; OC_NEWARK: 23T0852; PACKAGE: CASE-D8; SUPPLIER: PANASONIC; TOLERANCE: ±20 %; VOLTAGERATING: 25V
C8 C9 = Kemet-C0402C104K8PACTU:C0402C104K8PACTU: CAPACITOR, 0402; MPN: C0402C104K8PACTU; OC_FARNELL: 1288282; OC_NEWARK: 78H4791; SUPPLIER: Kemet; TOLERANCE: ±10%; VOLTAGERATING: 10V
J1 = fcounter:AMP2X4
MICROZED1 = di_microzed (1):MICROZED_REV_F: This library is distributed in the hope that it will be useful, but is provided AS IS with ABSOLUTELY NO WARRANTY; The entire risk as to the quality of the library is with you. Should the library prove defective, you assume the cost of all necessary servicing, repair, correction and etc. In no event will any of the developers, or any other party, be liable to anyone for damages arising out of the use or inability to use the library. MicroZed Rev F - based on schematics at: http://zedboard.com/sites/default/files/documentations/MicroZed_RevF_Schematic_140128.pdf
R1-R9 R20 R21 = Panasonic-ERJ2RKF_02:ERJ-2RKF4701X: RESISTOR, 0402; MPN: ERJ-2RKF4701X; OC_FARNELL: 1748238; OC_NEWARK: 64R5288; SUPPLIER: Panasonic; TOLERANCE: ± 1 %; WATTAGE: 0.1 W
R10-R19 = Panasonic-ERJ2RKF_00:ERJ-2RKF: Precision Thick Film Chip Resistors,0402,0.1 W,±1 %; MPN: ERJ-2RKF1022X; OC_FARNELL: 2282634; OC_NEWARK: 53W4182; PACKAGE: 0402; POWERRATING: 100mW; SUPPLIER: PANASONIC; TOLERANCE: ±1%
R34 = Panasonic-ERJ2RKF_00:ERJ-2RKF: Precision Thick Film Chip Resistors,0402,0.1 W,±1 %; MPN: ERJ-2RKF2670X; OC_FARNELL: 2282764; OC_NEWARK: 53W4300; PACKAGE: 0402; POWERRATING: 100mW; SUPPLIER: PANASONIC; TOLERANCE: ±1%
R35 = Panasonic-ERJ2RKF_01:ERJ-2RKF: Precision Thick Film Chip Resistors,0402,0.1 W,±1 %; MPN: ERJ-2RKF4320X; OC_FARNELL: 2282846; OC_NEWARK: 53W4374; PACKAGE: 0402; POWERRATING: 0.1 W; SUPPLIER: PANASONIC; TOLERANCE: ±1 %
R36 = Panasonic-ERJ2RKF_01:ERJ-2RKF: Precision Thick Film Chip Resistors,0402,0.1 W,±1 %; MPN: ERJ-2RKF6190X; OC_FARNELL: 2282908; OC_NEWARK: 53W4429; PACKAGE: 0402; POWERRATING: 0.1 W; SUPPLIER: PANASONIC; TOLERANCE: ±1 %
R40 = Panasonic-ERJ2RKF_00:ERJ-2RKF: Precision Thick Film Chip Resistors,0402,0.1 W,±1 %; MPN: ERJ-2RKF1021X; OC_FARNELL: 2282633; OC_NEWARK: 53W4181; PACKAGE: 0402; POWERRATING: 100mW; SUPPLIER: PANASONIC; TOLERANCE: ±1%
R42 = Panasonic-ERJ2RKF_01:ERJ-2RKF: Precision Thick Film Chip Resistors,0402,0.1 W,±1 %; MPN: ERJ-2RKF3921X; OC_FARNELL: 2282829; OC_NEWARK: 53W4358; PACKAGE: 0402; POWERRATING: 0.1 W; SUPPLIER: PANASONIC; TOLERANCE: ±1 %
S3 = switch-dil:219-02*: Surface Mount DIP Switch Series 219 SMT CTS Electronic Components Sourc: www.ctscorp.com; OC_FARNELL: unknown; OC_NEWARK: unknown
SV1 = con-ml:ML10: HARTING; OC_FARNELL: unknown; OC_NEWARK: unknown
SV2 = con-ml:ML6: HARTING; OC_FARNELL: unknown; OC_NEWARK: unknown
U1 = PCA9547PW:PCA9547PW: IC, 8-channel I2C-bus multiplexer with reset, 16TSSOP; MPN: PCA9547PW; OC_FARNELL: 2212121; OC_NEWARK: 55W4321; PACKAGE: TSSOP-24; SUPPLIER: NXP
U2-U5 = AD5242:AD5242BRZ100: I2C-Compatible,256-Position Digital Potentiometers; MPN: AD5242BRZ100; OC_FARNELL: 1079336; OC_NEWARK: 59K3700; PACKAGE: SOIC-16; SUPPLIER: Analog Devices
U6-U8 = TI-PTR08060WVD:PTR08060WVD: NON-ISOLATED ADJUSTABLE WIDE-OUTPUT, SWITCHING REGULATOR,SIP-5; MPN: PTR08060WVD; OC_FARNELL: 1903397; OC_NEWARK: 58M1091; PACKAGE: SIP-5; SUPPLIER: TEXAS INSTRUMENTS
U9 = Microchip-24AA02E48-I_SN:24AA02E48-I/SN: 128-Bit I2C™ Bus Serial EEPROM,SOIC-8; MPN: 24AA02E48-I/SN; OC_FARNELL: 1688857; OC_NEWARK: 45P4894; PACKAGE: SOIC-8; SUPPLIER: MICROCHIP
X1 = con-ptr500:AK300/2: CONNECTOR; OC_FARNELL: unknown; OC_NEWARK: unknown
X2 = con-molex:0446200002: RJ-45 INVERTED MODULAR JACK ASSEMBLY WITH RJ-11 KEEPOUT FEATURE Source: Data sheet <http://www.farnell.com/datasheets/73207.pdf> MOLEX 0446200002 BUCHSE, RJ45, GESCHIRMT Source: Farnell <http://de.farnell.com/molex/0446200002/buchse-rj45-geschirmt/dp/9251910?ost=9251910>; MF: MOLEX; MPN: 0446200002; OC_FARNELL: 9251910

## Module SPORT
Ports: GP1(in) GP2(in) GP3(in) TX(in) RX(out) GP0(in) TXO(out) RXO(in) PWR(out) CLK(out) REXT(io) +3V3(pwr) +5V(pwr) +12V(pwr) GND(pwr)
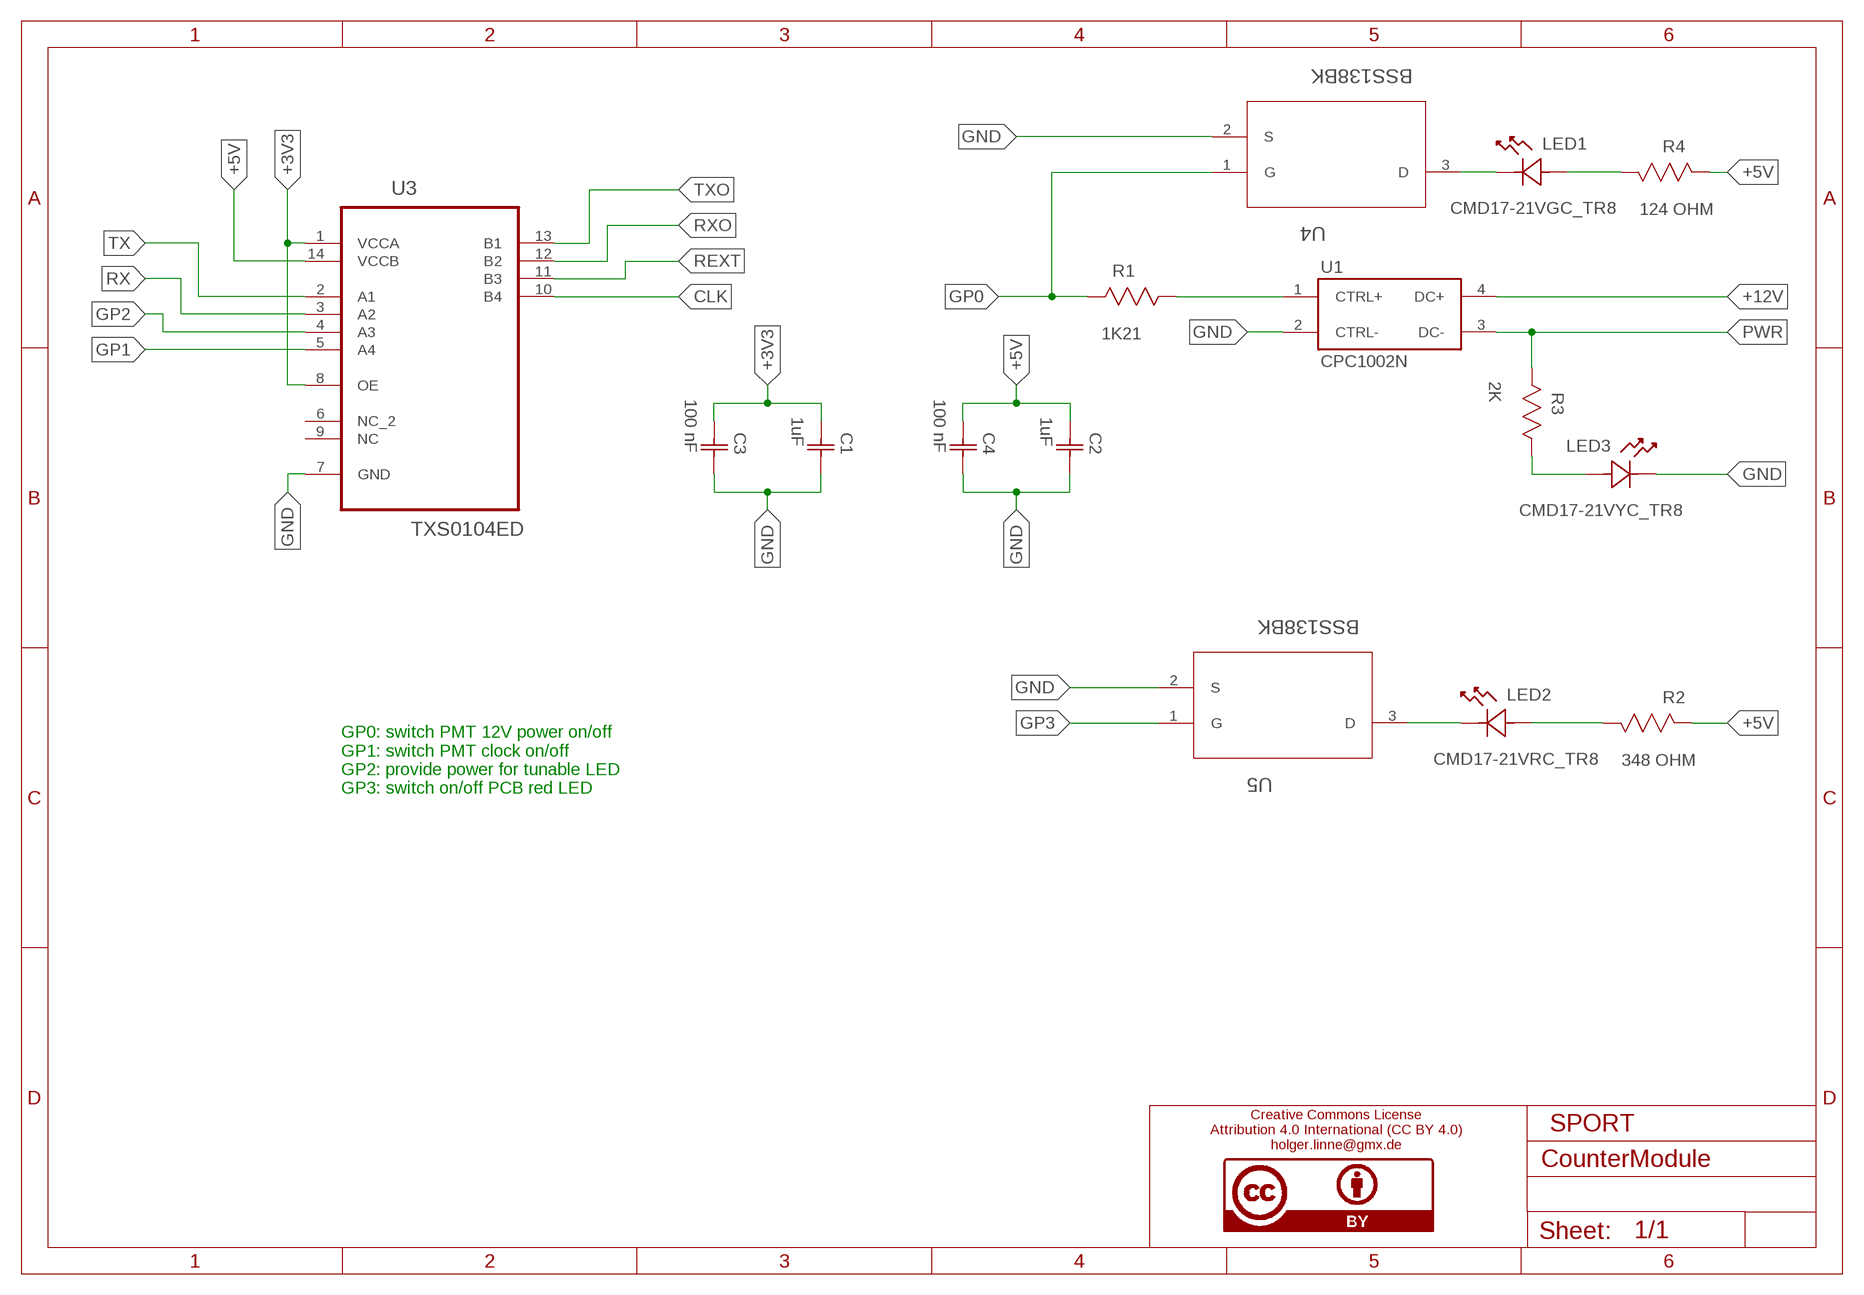
[diagram p6: schematic, module SPORT, sheet 1]

### Parts
C1  1uF  CC0603KRX5R6BB105  [CAPC1608X90N]
C2  1uF  CC0603KRX5R6BB105  [CAPC1608X90N]
C3  100 nF  C0402C104K8PACTU  [CAPC1005X60N]
C4  100 nF  C0402C104K8PACTU  [CAPC1005X60N]
LED1  CMD17-21VGC_TR8  [LED_CMD17-21VGC_TR8]
LED2  CMD17-21VRC_TR8  [LED_CMD17-21VRC_TR8]
LED3  CMD17-21VYC_TR8  [LED_CMD17-21VYC_TR8]
R1  1K21  ERJ-2RKF1211X  [RESC1005X40N]
R2  348 OHM  ERJ-2RKF3480X  [RESC1005X40N]
R3  2K  ERJ-2RKF2001X  [RESC1005X40N]
R4  124 OHM  ERJ-2RKF1240X  [RESC1005X40N]
U1  CPC1002N  CPC1002NSMD  [4-SOP]
U3  TXS0104ED  [SOIC127P600X175-14N]
U4  BSS138BK  [SOT65P210X110-3N]
U5  BSS138BK  [SOT65P210X110-3N]

### Nets
+3V3 [power]: C1.1(C1) C3.1(C1) U3.1(VCCA) U3.8(OE)
+5V [power]: C2.1(C1) C4.1(C1) R2.2(R2) R4.2(R2) U3.14(VCCB)
+12V [power]: U1.4(DC+)
CLK: U3.10(B4)
GND [power]: C1.2(C2) C2.2(C2) C3.2(C2) C4.2(C2) LED3.2 U1.2(CTRL-) U3.7(GND) U4.2(S) U5.2(S)
GP0: R1.2(R2) U4.1(G)
GP1: U3.5(A4)
GP2: U3.4(A3)
GP3: U5.1(G)
N$1: LED1.1 R4.1(R1)
N$2: LED2.1 R2.1(R1)
N$3: R1.1(R1) U1.1(CTRL+)
N$4: LED1.2 U4.3(D)
N$5: LED2.2 U5.3(D)
N$6: LED3.1 R3.1(R1)
PWR [power]: R3.2(R2) U1.3(DC-)
REXT: U3.11(B3)
RX: U3.3(A2)
RXO: U3.12(B2)
TX: U3.2(A1)
TXO: U3.13(B1)
Unconnected: U3.6(NC_2) U3.9(NC)

### Notes on the sheet
- GP0: switch PMT 12V power on/off
  GP1: switch PMT clock on/off
  GP2: provide power for tunable LED
  GP3: switch on/off PCB red LED
- SPORT
- Creative Commons License
  Attribution 4.0 International (CC BY 4.0)
  holger.linne@gmx.de
- /Users/hll/bypig.bmp

### Library data of the parts
C1 C2 = Yageo-CC0603KRX5R6BB105:CC0603KRX5R6BB105: CAPACITOR, 0603; MPN: CC0603KRX5R6BB105; OC_FARNELL: 9402080; OC_NEWARK: 68R4757; SUPPLIER: YAGEO; TOLERANCE: ±10%; VOLTAGERATING: 10V
C3 C4 = Kemet-C0402C104K8PACTU:C0402C104K8PACTU: CAPACITOR, 0402; MPN: C0402C104K8PACTU; OC_FARNELL: 1288282; OC_NEWARK: 78H4791; SUPPLIER: Kemet; TOLERANCE: ±10%; VOLTAGERATING: 10V
LED1 = CMLighting-CMD17-21VxC_TR8:CMD17-21VGC_TR8: LED, GREEN, 10MCD, 570NM; LEDCOLOR: Green; MPN: CMD17-21VGC/TR8; OC_FARNELL: 4539102; OC_NEWARK: 34C8661; PACKAGE: 2 -PIN LED; SUPPLIER: CHICAGO MINIATURE LIGHTING
LED2 = CMLighting-CMD17-21VxC_TR8:CMD17-21VRC_TR8: LED, RED, 13MCD, 640NM; LEDCOLOR: RED; MPN: CMD17-21VRC_TR8; OC_FARNELL: 4539126; OC_NEWARK: 34C8663; PACKAGE: 2 -PIN LED; SUPPLIER: CHICAGO MINIATURE LIGHTING
LED3 = CMLighting-CMD17-21VxC_TR8:CMD17-21VYC_TR8: LED, YELLOW, 12MCD, 585NM; LEDCOLOR: YELLOW; MPN: CMD17-21VYC_TR8; OC_FARNELL: 4539140; OC_NEWARK: 34C8665; PACKAGE: 2 -PIN LED; SUPPLIER: CHICAGO MINIATURE LIGHTING
R1 = Panasonic-ERJ2RKF_00:ERJ-2RKF: Precision Thick Film Chip Resistors,0402,0.1 W,±1 %; MPN: ERJ-2RKF1211X; OC_FARNELL: 2059129; OC_NEWARK: 73T6471; PACKAGE: 0402; POWERRATING: 100mW; SUPPLIER: PANASONIC; TOLERANCE: ±1%
R2 = Panasonic-ERJ2RKF_00:ERJ-2RKF: Precision Thick Film Chip Resistors,0402,0.1 W,±1 %; MPN: ERJ-2RKF3480X; OC_FARNELL: 2282802; OC_NEWARK: 53W4333; PACKAGE: 0402; POWERRATING: 100mW; SUPPLIER: PANASONIC; TOLERANCE: ±1%
R3 = Panasonic-ERJ2RKF_00:ERJ-2RKF: Precision Thick Film Chip Resistors,0402,0.1 W,±1 %; MPN: ERJ-2RKF2001X; OC_FARNELL: 2059132; OC_NEWARK: 73T6486; PACKAGE: 0402; POWERRATING: 100mW; SUPPLIER: PANASONIC; TOLERANCE: ±1%
R4 = Panasonic-ERJ2RKF_00:ERJ-2RKF: Precision Thick Film Chip Resistors,0402,0.1 W,±1 %; MPN: ERJ-2RKF1240X; OC_FARNELL: 2282654; OC_NEWARK: 53W4200; PACKAGE: 0402; POWERRATING: 100mW; SUPPLIER: PANASONIC; TOLERANCE: ±1%
U1 = CPC1002N:CPC1002N: Digi-Key part: CLA230TR-ND http://www.digikey.com/product-detail/en/CPC1002NTR/CLA230TR-ND/1023460 http://www.clare.com/home/pdfs.nsf/www/CPC1002N.pdf/$file/CPC1002N.pdf
U3 = Texas Instruments_By_element14_Batch_1:TXS0104ED: 4-BIT BIDIRECTIONAL VOLTAGE-LEVEL TRANSLATOR FOR OPEN-DRAIN AND PUSH-PULL APPLICATIONS; MPN: TXS0104ED; OC_FARNELL: 1607892; OC_NEWARK: 10M0686; PACKAGE: SOIC-14; SUPPLIER: TEXAS INSTRUMENTS
U4 = NXP-BSS138BK:BSS138BK: N-channel Trench MOSFET; MPN: BSS138BKW; OC_FARNELL: 2053836; PACKAGE: SOT-323; SUPPLIER: NXP
U5 = NXP-BSS138BK:BSS138BK: N-channel Trench MOSFET; MPN: BSS138BK; OC_FARNELL: 2053833; OC_NEWARK: 61T7486; PACKAGE: SOT-23-3; SUPPLIER: NXP

## Module SERIAL
Ports: SCL(in) SDA(io) REXT1(io) REXT2(io) REXT3(io) REXT4(io) RXD1(in) RXD2(in) RXD3(in) RXD4(in) TXD1(out) TXD2(out) TXD3(out) TXD4(out) CLK1(out) CLK2(out) CLK3(out) CLK4(out) PWR1(out) PWR2(out) PWR3(out) PWR4(out) +3V3(pwr) +5V(pwr) +12V(pwr) GND(pwr)
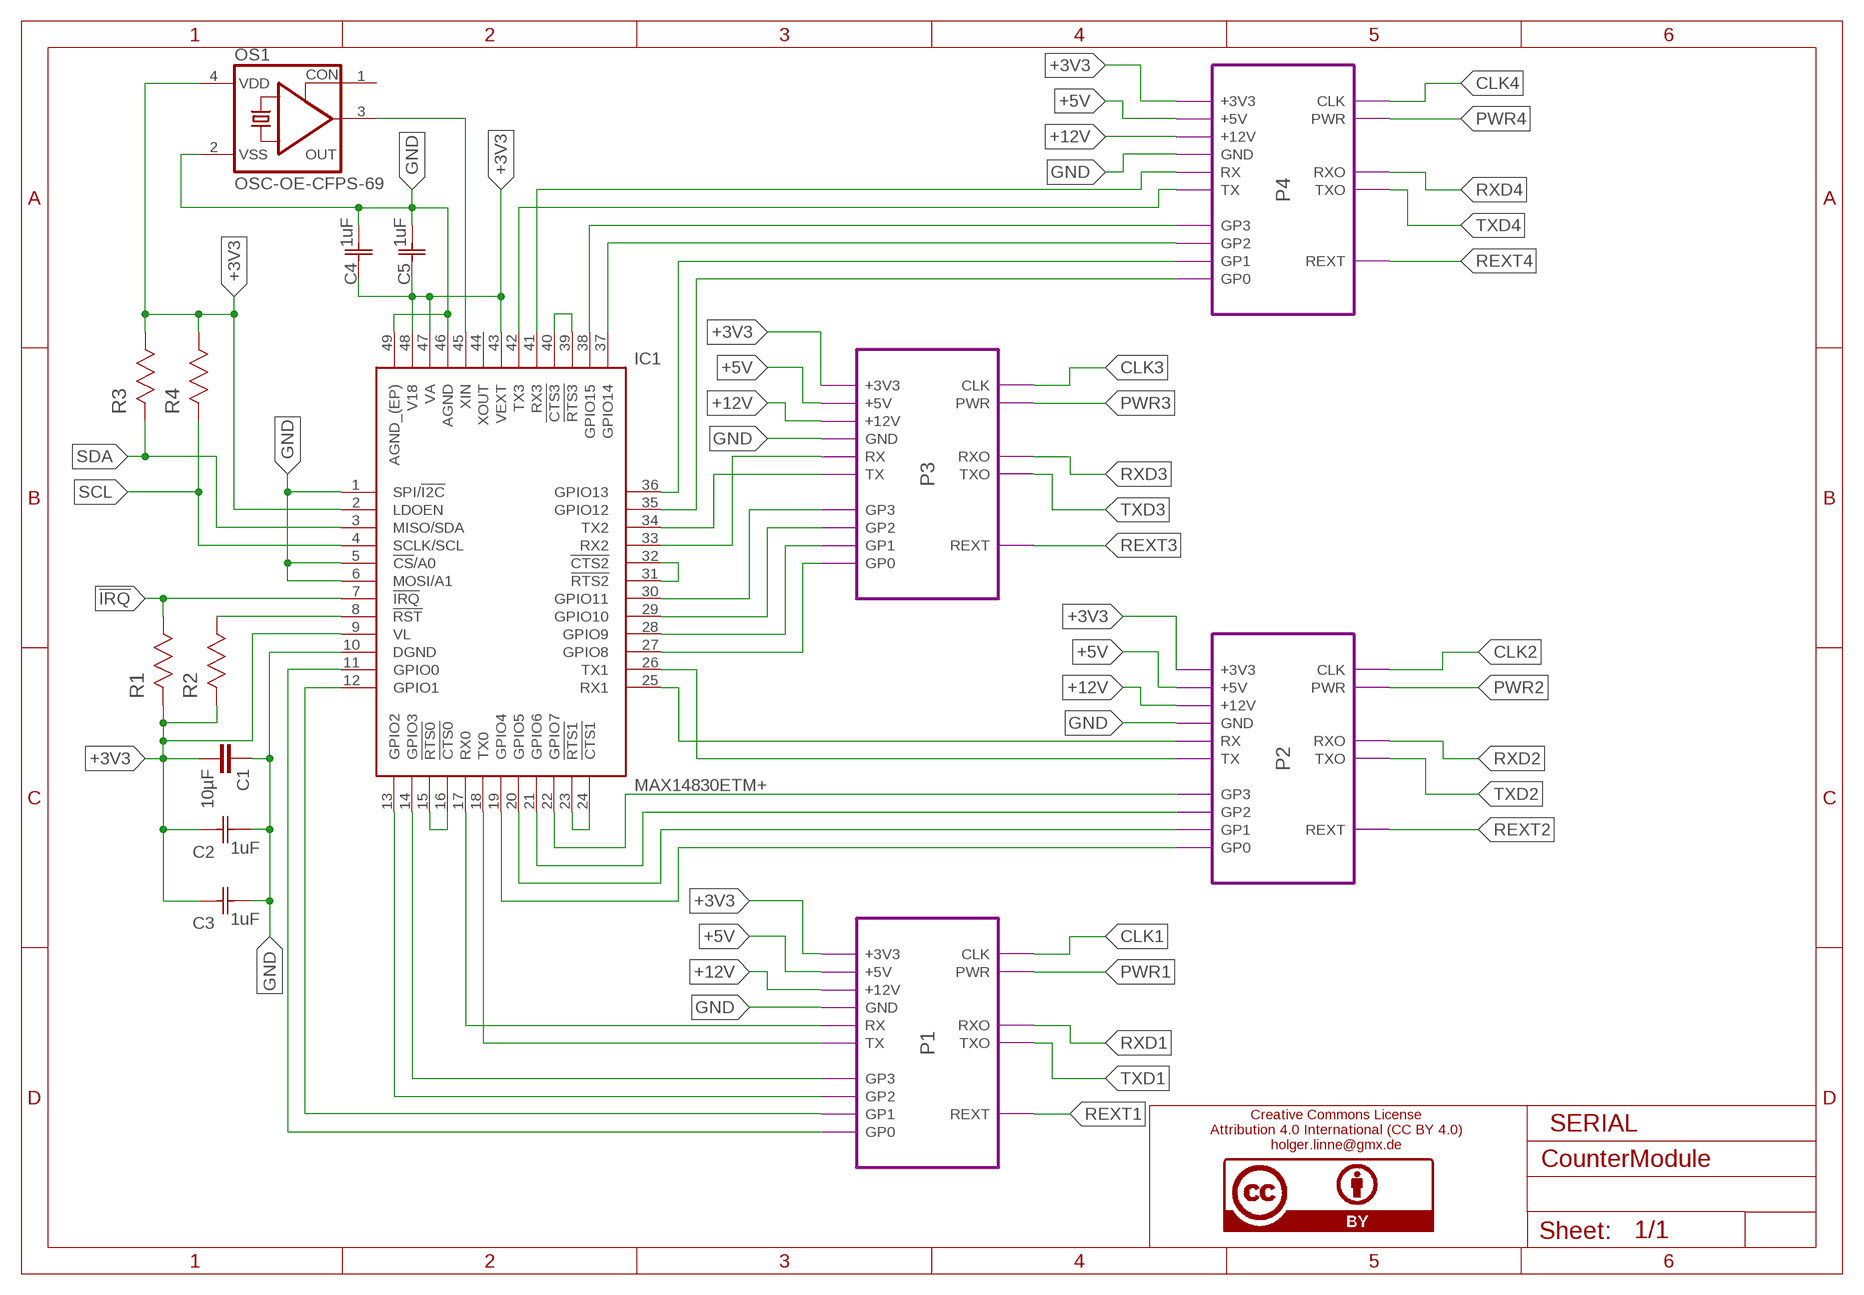
[diagram p7: schematic, module SERIAL, sheet 1]

### Parts
C1  10µF  C-EUC0805  [C0805]
C2  1uF  CC0603KRX5R6BB105  [CAPC1608X90N]
C3  1uF  CC0603KRX5R6BB105  [CAPC1608X90N]
C4  1uF  CC0603KRX5R6BB105  [CAPC1608X90N]
C5  1uF  CC0603KRX5R6BB105  [CAPC1608X90N]
IC1  MAX14830ETM+  [QFN50P700X700X80-49N]
OS1  OSC-OE-CFPS-69  [5.0X3.2-4-PAD]
R1  4.7 kOhm  ERJ-2RKF4701X  [RESC1005X40N]
R2  4.7 kOhm  ERJ-2RKF4701X  [RESC1005X40N]
R3  4.7 kOhm  ERJ-2RKF4701X  [RESC1005X40N]
R4  4.7 kOhm  ERJ-2RKF4701X  [RESC1005X40N]

### Module instances
P1 = SPORT
P2 = SPORT
P3 = SPORT
P4 = SPORT

### Nets
!IRQ: IC1.7(!IRQ) R1.1(R1)
+3V3 [power]: C1.2 C2.1(C1) C3.1(C1) C4.1(C1) C5.1(C1) IC1.2(LDOEN) IC1.9(VL) IC1.43(VEXT) IC1.47(VA) IC1.48(V18) OS1.4(VDD) R1.2(R2) R2.2(R2) R3.1(R1) R4.1(R1) ; port P4.+3V3 P2.+3V3 P1.+3V3 P3.+3V3
+5V: port P4.+5V P2.+5V P1.+5V P3.+5V
+12V: port P4.+12V P2.+12V P1.+12V P3.+12V
CLK1: port P1.CLK
CLK2: port P2.CLK
CLK3: port P3.CLK
CLK4: port P4.CLK
GND [power]: C1.1 C2.2(C2) C3.2(C2) C4.2(C2) C5.2(C2) IC1.1(SPI/!I2C) IC1.5(!CS!/A0) IC1.6(MOSI/A1) IC1.10(DGND) IC1.46(AGND) IC1.49(AGND_(EP)) OS1.2(VSS) ; port P4.GND P2.GND P1.GND P3.GND
GPIO0: IC1.11(GPIO0) ; port P1.GP0
GPIO1: IC1.12(GPIO1) ; port P1.GP1
GPIO2: IC1.13(GPIO2) ; port P1.GP2
GPIO3: IC1.14(GPIO3) ; port P1.GP3
GPIO4: IC1.19(GPIO4) ; port P2.GP0
GPIO5: IC1.20(GPIO5) ; port P2.GP1
GPIO7: IC1.22(GPIO7) ; port P2.GP3
GPIO8: IC1.27(GPIO8) ; port P3.GP0
GPIO9: IC1.28(GPIO9) ; port P3.GP1
GPIO10: IC1.29(GPIO10) ; port P3.GP2
GPIO11: IC1.30(GPIO11) ; port P3.GP3
GPIO12: IC1.35(GPIO12) ; port P4.GP0
GPIO13: IC1.36(GPIO13) ; port P4.GP1
GPIO14: IC1.37(GPIO14) ; port P4.GP2
GPIO15: IC1.38(GPIO15) ; port P4.GP3
GPIUO6: IC1.21(GPIO6) ; port P2.GP2
N$1: IC1.15(!RTS0) IC1.16(!CTS0)
N$2: IC1.23(!RTS1) IC1.24(!CTS1)
N$3: IC1.31(!RTS2) IC1.32(!CTS2)
N$4: IC1.39(!RTS3) IC1.40(!CTS3)
N$5: IC1.8(!RST) R2.1(R1)
N$6: IC1.45(XIN) OS1.3(OUT)
PWR1 [power]: port P1.PWR
PWR2 [power]: port P2.PWR
PWR3 [power]: port P3.PWR
PWR4 [power]: port P4.PWR
REXT1: port P1.REXT
REXT2: port P2.REXT
REXT3: port P3.REXT
REXT4: port P4.REXT
RX0: IC1.17(RX0) ; port P1.RX
RX1: IC1.25(RX1) ; port P2.RX
RX2: IC1.33(RX2) ; port P3.RX
RX3: IC1.41(RX3) ; port P4.RX
RXD1: port P1.RXO
RXD2: port P2.RXO
RXD3: port P3.RXO
RXD4: port P4.RXO
SCL: IC1.4(SCLK/SCL) R4.2(R2)
SDA: IC1.3(MISO/SDA) R3.2(R2)
TX0: IC1.18(TX0) ; port P1.TX
TX1: IC1.26(TX1) ; port P2.TX
TX2: IC1.34(TX2) ; port P3.TX
TX3: IC1.42(TX3) ; port P4.TX
TXD1: port P1.TXO
TXD2: port P2.TXO
TXD3: port P3.TXO
TXD4: port P4.TXO
Unconnected: IC1.44(XOUT) OS1.1(CON)

### Notes on the sheet
- SERIAL
- Creative Commons License
  Attribution 4.0 International (CC BY 4.0)
  holger.linne@gmx.de
- /Users/hll/bypig.bmp

### Library data of the parts
C1 = rcl:C-EU: CAPACITOR, European symbol; COMMENT: 10µF ±10% 6.3V X7R ceramic; EXAMPLE: Murata GRM21BR70J106K
C2-C5 = Yageo-CC0603KRX5R6BB105:CC0603KRX5R6BB105: CAPACITOR, 0603; MPN: CC0603KRX5R6BB105; OC_FARNELL: 9402080; OC_NEWARK: 68R4757; SUPPLIER: YAGEO; TOLERANCE: ±10%; VOLTAGERATING: 10V
IC1 = MAX14830ETM+:MAX14830ETM+: MAX14830ETM+, Universal Asynchronous Receiver & Transmitter 4-channel RS485 24MBd, 2.35 3.6 V, 48-Pin, TQFN <https://componentsearchengine.com/Images/3/MAX14830ETM%2B.jpg> Source: Datasheet <http://datasheets.maximintegrated.com/en/ds/MAX14830.pdf>; DESCRIPTION: MAX14830ETM+, Universal Asynchronous Receiver & Transmitter 4-channel RS485 24MBd, 2.35 3.6 V, 48-Pin, TQFN; HEIGHT: 0.8mm; MANUFACTURER_NAME: Maxim Integrated; MANUFACTURER_PART_NUMBER: MAX14830ETM+; RS_PART_NUMBER: 7860907; SUPPLIER_NAME: RS
OS1 = IQD-Frequency-Products:OSC-OE: OSCILLATOR WITH OE; FREQUENCY: 3.6864MHz; MF: IQD Frequency Products; MFN: LFSPXO009581; OC_FARNELL: 1276668
R1-R4 = Panasonic-ERJ2RKF_02:ERJ-2RKF4701X: RESISTOR, 0402; MPN: ERJ-2RKF4701X; OC_FARNELL: 1748238; OC_NEWARK: 64R5288; SUPPLIER: Panasonic; TOLERANCE: ± 1 %; WATTAGE: 0.1 W

## Net classes
0 default: width 0.15 mm, drill 0.254 mm, clearance 0.15 mm
1 power: width 0.25 mm, drill 0.254 mm, clearance 0.305 mm to class 0, clearance 0.305 mm
2 xpower: width 0.35 mm, drill 0.254 mm, clearance 0.305 mm to class 0, clearance 0.305 mm to class 1, clearance 0.305 mm